# EAGLE schematic qsd67lc_v2 (EAGLE 9.3.1)

## Sheet 1 of 12: Supply
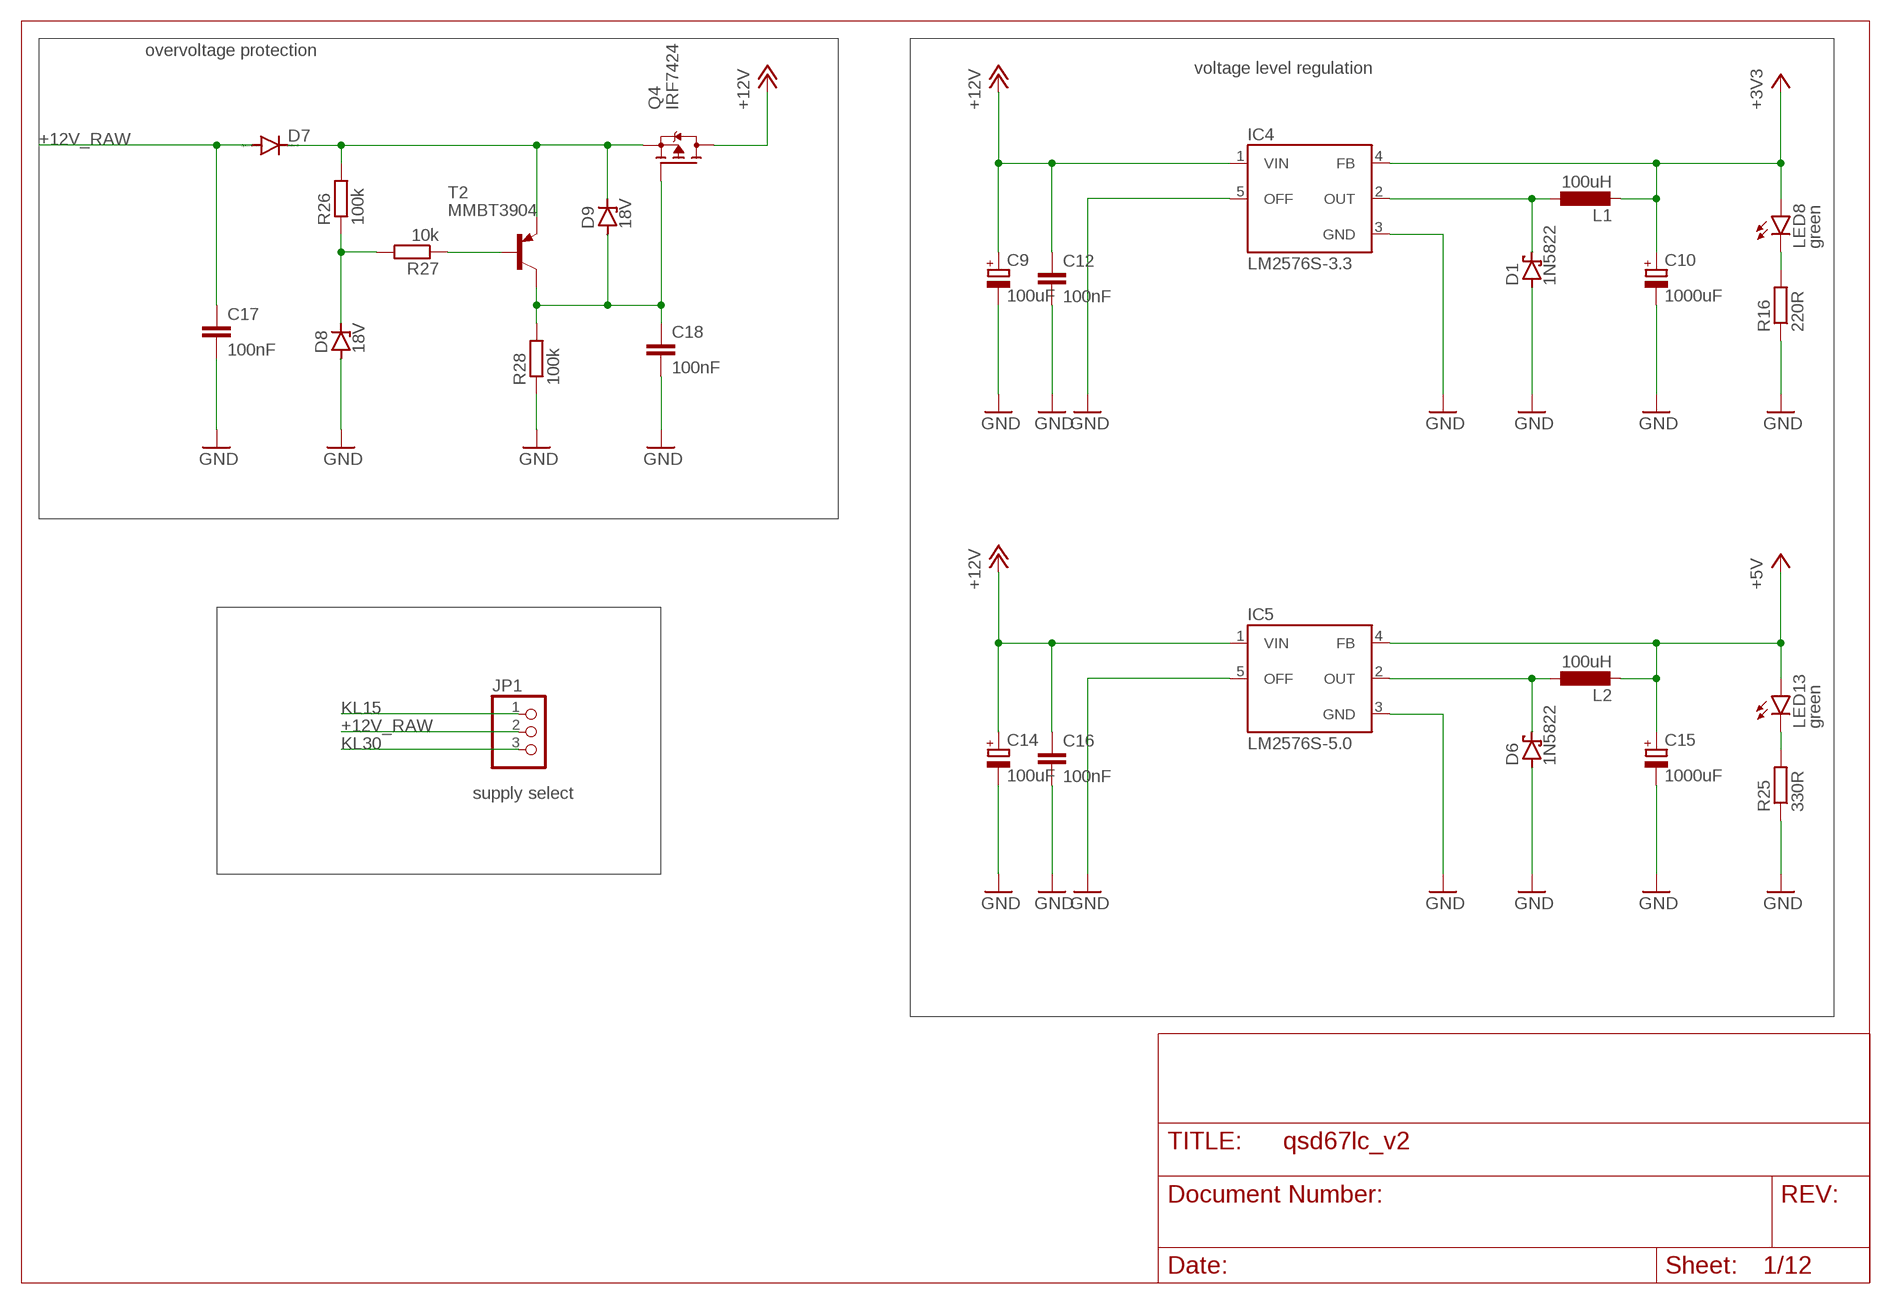
[diagram p0: schematic, sheet 1]

### Parts
C9  100uF  CPOL-EUE5-10.5  [E5-10,5]
C10  1000uF  CPOL-EUE5-10.5  [E5-10,5]
C12  100nF  C-EUC0805  [C0805]
C14  100uF  CPOL-EUE5-10.5  [E5-10,5]
C15  1000uF  CPOL-EUE5-10.5  [E5-10,5]
C16  100nF  C-EUC0805  [C0805]
C17  100nF  C-EUC0805  [C0805]
C18  100nF  C-EUC0805  [C0805]
D1  1N5822  SCHOTTKY-DIODEDO201T15  [DO201T15]
D6  1N5822  SCHOTTKY-DIODEDO201T15  [DO201T15]
D7  DIODE-SOD123  [SOD123]
D8  18V  ZENER-DIODESOD80C  [SOD80C]
D9  18V  ZENER-DIODESOD80C  [SOD80C]
IC4  LM2576S-3.3  LM2576S  [TO263-5]
IC5  LM2576S-5.0  LM2576S  [TO263-5]
JP1  PINHD-1X3  [1X03]
L1  100uH  L-LEU-09HCP  [09HCP]
L2  100uH  L-LEU-09HCP  [09HCP]
LED8  green  LEDCHIP-LED0805  [CHIP-LED0805]
LED13  green  LEDCHIP-LED0805  [CHIP-LED0805]
Q4  IRF7424  BSO201SP  [SO-8]
R16  220R  R-EU_R0805  [R0805]
R25  330R  R-EU_R0805  [R0805]
R26  100k  R-EU_R0805  [R0805]
R27  10k  R-EU_R0805  [R0805]
R28  100k  R-EU_R0805  [R0805]
T2  MMBT3904  BC807-16-PNP-SOT23-BEC  [SOT23-BEC]

### Nets
+3V3: C10.+ IC4.4(FB) L1.P$2 LED8.A ; also sheet 2,3,4,7,8,9,10,11
+5V: C15.+ IC5.4(FB) L2.P$2 LED13.A ; also sheet 2,10,11
+12V: C9.+ C12.1 C14.+ C16.1 IC4.1(VIN) IC5.1(VIN) Q4.5(D) Q4.6(D) Q4.7(D) Q4.8(D) ; also sheet 2,5,9,11
+12V_RAW: C17.1 D7.A JP1.2
GND: C9.- C10.- C12.2 C14.- C15.- C16.2 C17.2 C18.2 D1.A D6.A D8.A IC4.3(GND) IC4.5(OFF) IC5.3(GND) IC5.5(OFF) R16.1 R25.1 R28.1 ; also sheet 2,3,4,5,6,7,8,9,10,11
KL15: JP1.1 ; also sheet 5,6
KL30: JP1.3 ; also sheet 8
N$11: LED8.C R16.2
N$19: D7.C D9.C Q4.1(S) Q4.2(S) Q4.3(S) R26.2 T2.E
N$22: D1.C IC4.2(OUT) L1.P$1
N$30: D6.C IC5.2(OUT) L2.P$1
N$31: LED13.C R25.2
N$32: D8.C R26.1 R27.2
N$33: R27.1 T2.B
N$34: C18.1 D9.A Q4.4(G) R28.2 T2.C

### Notes on the sheet
- overvoltage protection
- voltage level regulation
- supply select

## Sheet 2 of 12: atmega8
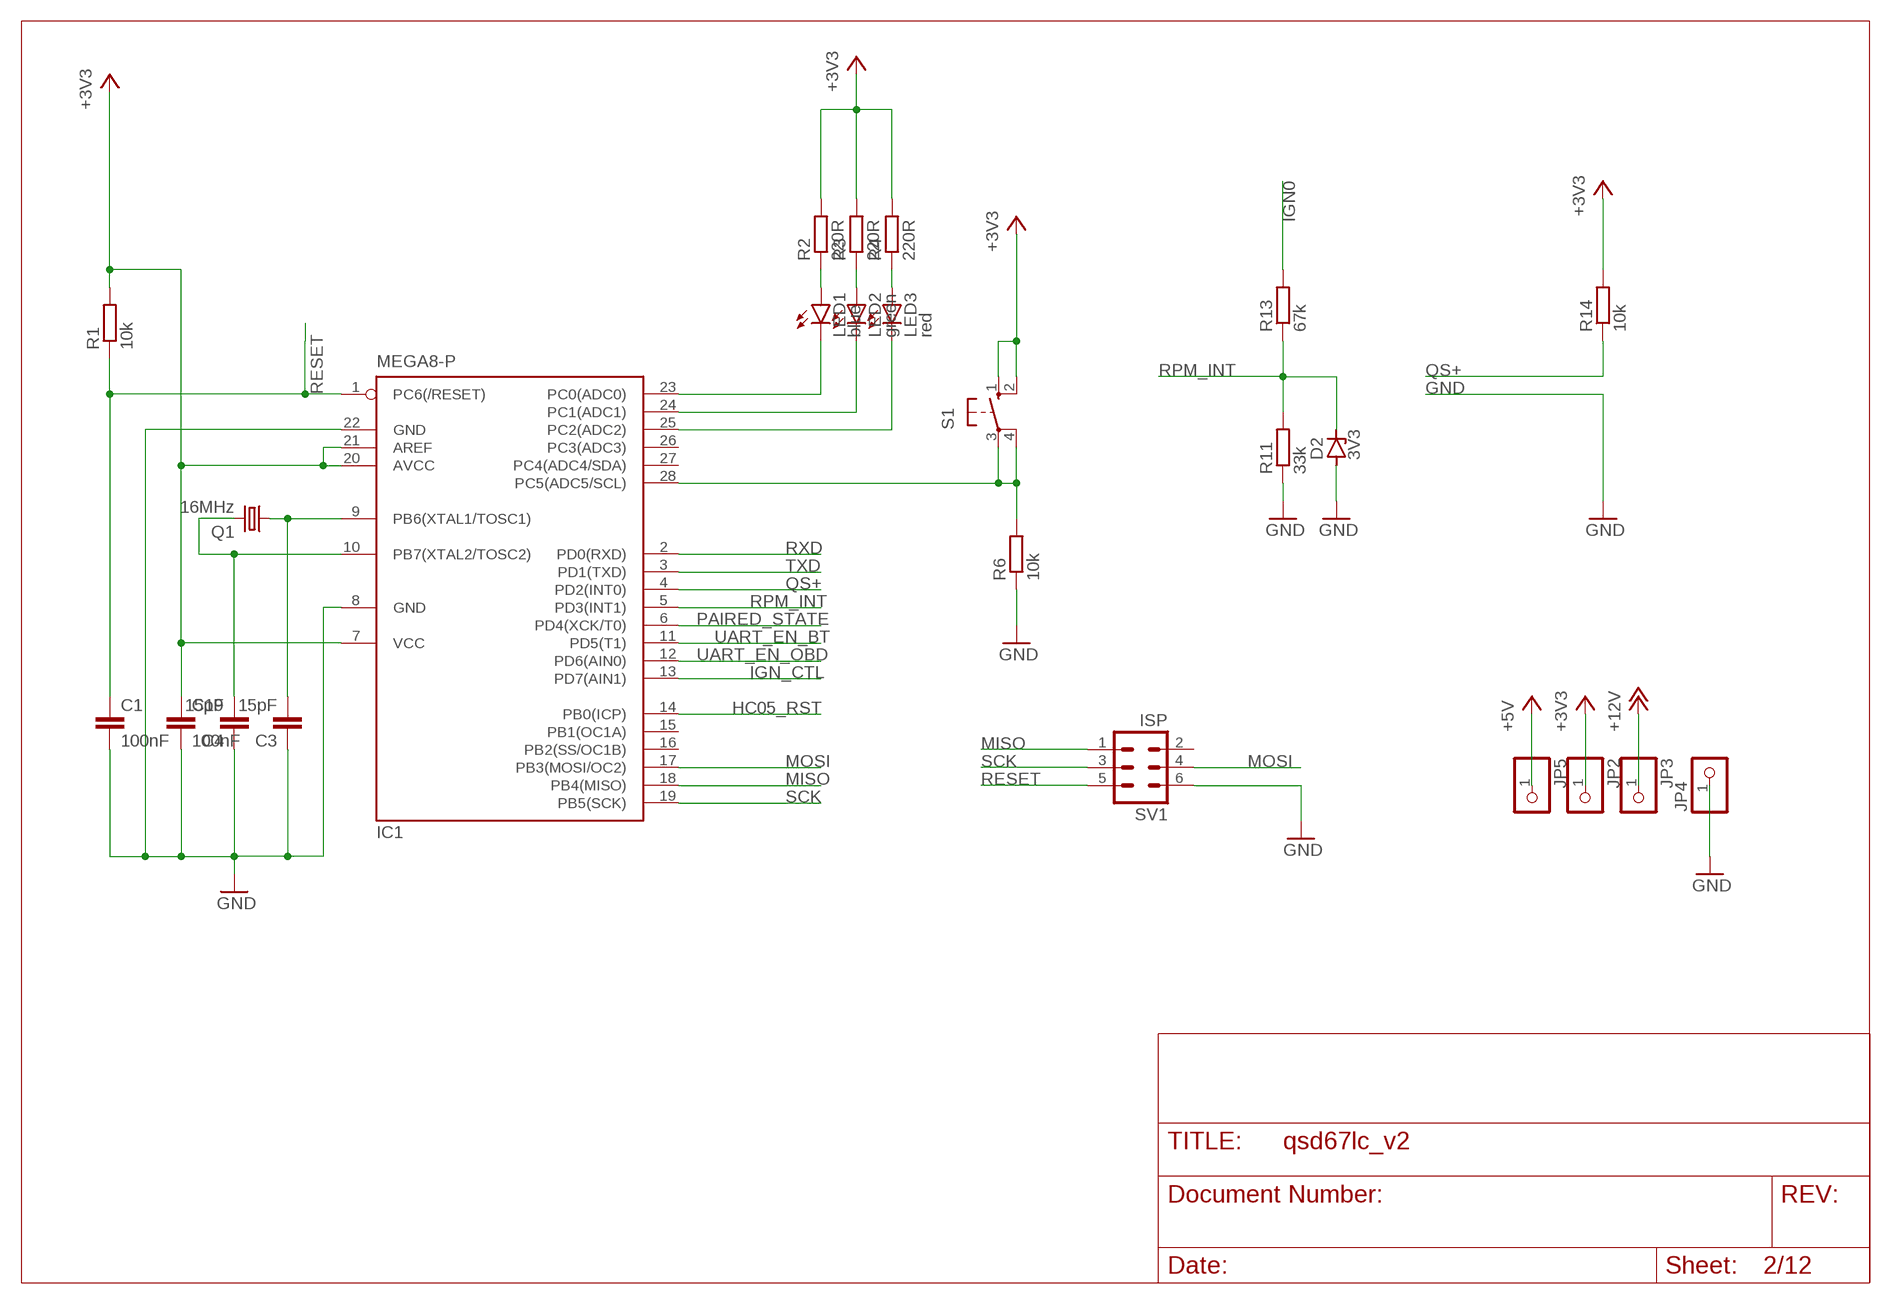
[diagram p1: schematic, sheet 2]

### Parts
C1  100nF  C-EUC0805  [C0805]
C3  15pF  C-EUC0805  [C0805]
C4  15pF  C-EUC0805  [C0805]
C19  100nF  C-EUC0805  [C0805]
D2  3V3  ZENER-DIODESOD80C  [SOD80C]
IC1  MEGA8-P  [DIL28-3]
JP2  PINHD-1X1  [1X01]
JP3  PINHD-1X1  [1X01]
JP4  PINHD-1X1  [1X01]
JP5  PINHD-1X1  [1X01]
LED1  blue  LEDCHIP-LED0805  [CHIP-LED0805]
LED2  green  LEDCHIP-LED0805  [CHIP-LED0805]
LED3  red  LEDCHIP-LED0805  [CHIP-LED0805]
Q1  16MHz  CRYSTALHC49U-V  [HC49U-V]
R1  10k  R-EU_R0805  [R0805]
R2  220R  R-EU_R0805  [R0805]
R3  220R  R-EU_R0805  [R0805]
R4  220R  R-EU_R0805  [R0805]
R6  10k  R-EU_R0805  [R0805]
R11  33k  R-EU_R0805  [R0805]
R13  67k  R-EU_R0805  [R0805]
R14  10k  R-EU_R0805  [R0805]
S1  10-XX  [B3F-10XX]
SV1  ISP  ML6  [ML6]

### Nets
+3V3: C19.1 IC1.7(VCC) IC1.20(AVCC) IC1.21(AREF) JP2.1 R1.2 R2.2 R3.2 R4.2 R14.2 S1.1(S) S1.2(S1) ; also sheet 1,3,4,7,8,9,10,11
+5V: JP5.1 ; also sheet 1,10,11
+12V: JP3.1 ; also sheet 1,5,9,11
GND: C1.2 C3.1 C4.1 C19.2 D2.A IC1.8(GND) IC1.22(GND) JP4.1 R6.1 R11.1 SV1.6 ; also sheet 1,3,4,5,6,7,8,9,10,11
HC05_RST: IC1.14(PB0(ICP)) ; also sheet 3
IGN0: R13.2 ; also sheet 6
IGN_CTL: IC1.13(PD7(AIN1)) ; also sheet 5
MISO: IC1.18(PB4(MISO)) SV1.1
MOSI: IC1.17(PB3(MOSI/OC2)) SV1.4
N$2: C3.2 IC1.9(PB6(XTAL1/TOSC1)) Q1.1
N$3: C4.2 IC1.10(PB7(XTAL2/TOSC2)) Q1.2
N$4: LED2.A R3.1
N$5: LED1.A R2.1
N$6: LED3.A R4.1
N$7: IC1.23(PC0(ADC0)) LED1.C
N$9: IC1.24(PC1(ADC1)) LED2.C
N$12: IC1.28(PC5(ADC5/SCL)) R6.2 S1.3(P) S1.4(P1)
N$20: IC1.25(PC2(ADC2)) LED3.C
PAIRED_STATE: IC1.6(PD4(XCK/T0)) ; also sheet 3
QS+: IC1.4(PD2(INT0)) R14.1 ; also sheet 6
RESET: C1.1 IC1.1(PC6(/RESET)) R1.1 SV1.5
RPM_INT: D2.C IC1.5(PD3(INT1)) R11.2 R13.1
RXD: IC1.2(PD0(RXD)) ; also sheet 4
SCK: IC1.19(PB5(SCK)) SV1.3
TXD: IC1.3(PD1(TXD)) ; also sheet 4
UART_EN_BT: IC1.11(PD5(T1)) ; also sheet 4
UART_EN_OBD: IC1.12(PD6(AIN0)) ; also sheet 4
Unconnected: IC1.15(PB1(OC1A)) IC1.16(PB2(SS/OC1B)) IC1.26(PC3(ADC3)) IC1.27(PC4(ADC4/SDA)) SV1.2

## Sheet 3 of 12: bluetooth
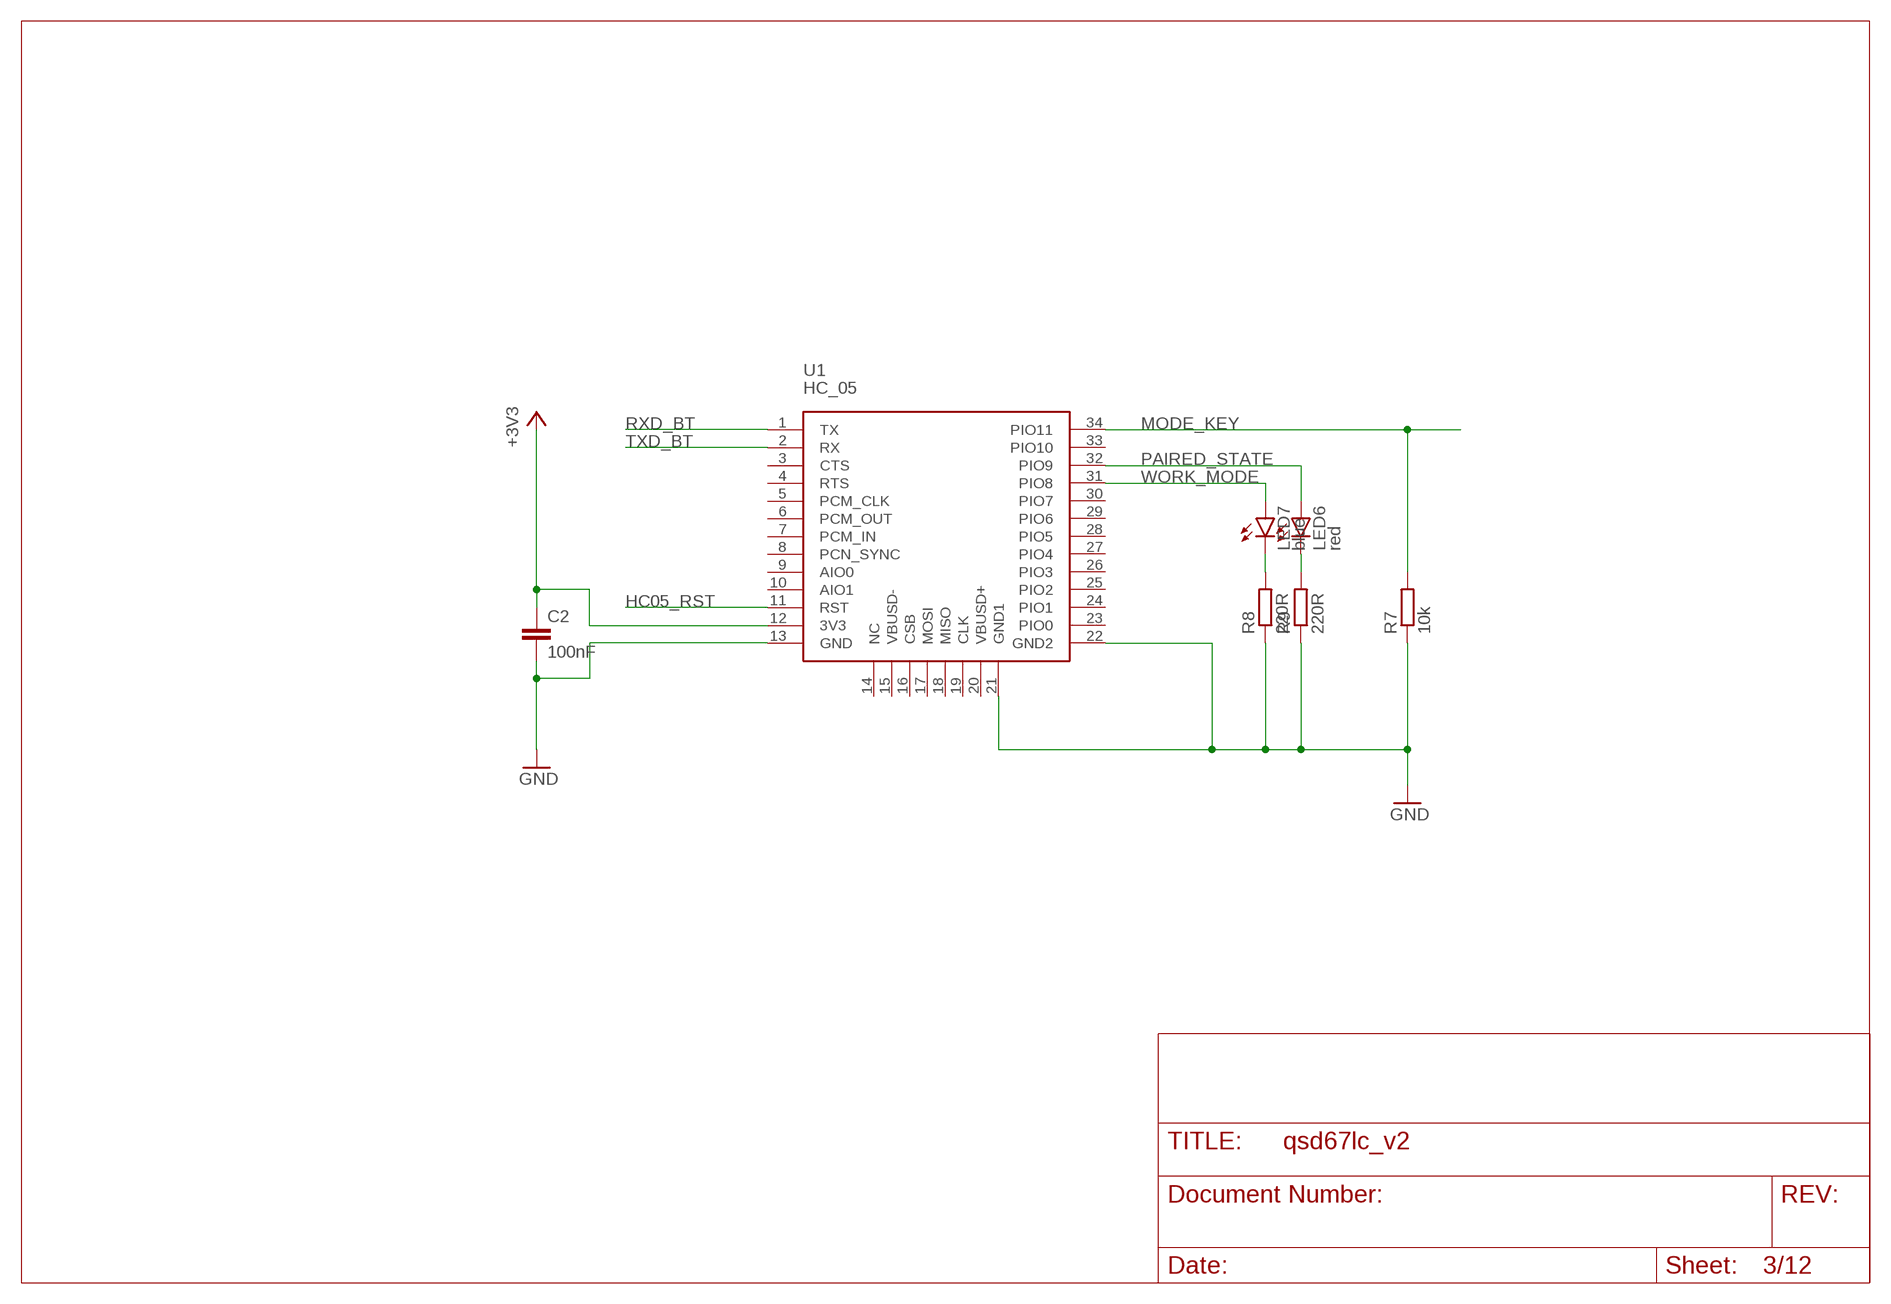
[diagram p2: schematic, sheet 3]

### Parts
C2  100nF  C-EUC0805  [C0805]
LED6  red  LEDCHIP-LED0805  [CHIP-LED0805]
LED7  blue  LEDCHIP-LED0805  [CHIP-LED0805]
R7  10k  R-EU_R0805  [R0805]
R8  220R  R-EU_R0805  [R0805]
R9  220R  R-EU_R0805  [R0805]
U1  HC_05  [BLUETOOTH_SMD]

### Nets
+3V3: C2.1 U1.12(3V3) ; also sheet 1,2,4,7,8,9,10,11
GND: C2.2 R7.1 R8.1 R9.1 U1.13(GND) U1.21(GND1) U1.22(GND2) ; also sheet 1,2,4,5,6,7,8,9,10,11
HC05_RST: U1.11(RST) ; also sheet 2
MODE_KEY: R7.2 U1.34(PIO11)
N$13: LED7.C R8.2
N$14: LED6.C R9.2
PAIRED_STATE: LED6.A U1.32(PIO9) ; also sheet 2
RXD_BT: U1.1(TX) ; also sheet 4
TXD_BT: U1.2(RX) ; also sheet 4
WORK_MODE: LED7.A U1.31(PIO8)
Unconnected: U1.3(CTS) U1.4(RTS) U1.5(PCM_CLK) U1.6(PCM_OUT) U1.7(PCM_IN) U1.8(PCN_SYNC) U1.9(AIO0) U1.10(AIO1) U1.14(NC) U1.15(VBUSD-) U1.16(CSB) U1.17(MOSI) U1.18(MISO) U1.19(CLK) U1.20(VBUSD+) U1.23(PIO0) U1.24(PIO1) U1.25(PIO2) U1.26(PIO3) U1.27(PIO4) U1.28(PIO5) U1.29(PIO6) U1.30(PIO7) U1.33(PIO10)

## Sheet 4 of 12: UART switch logic
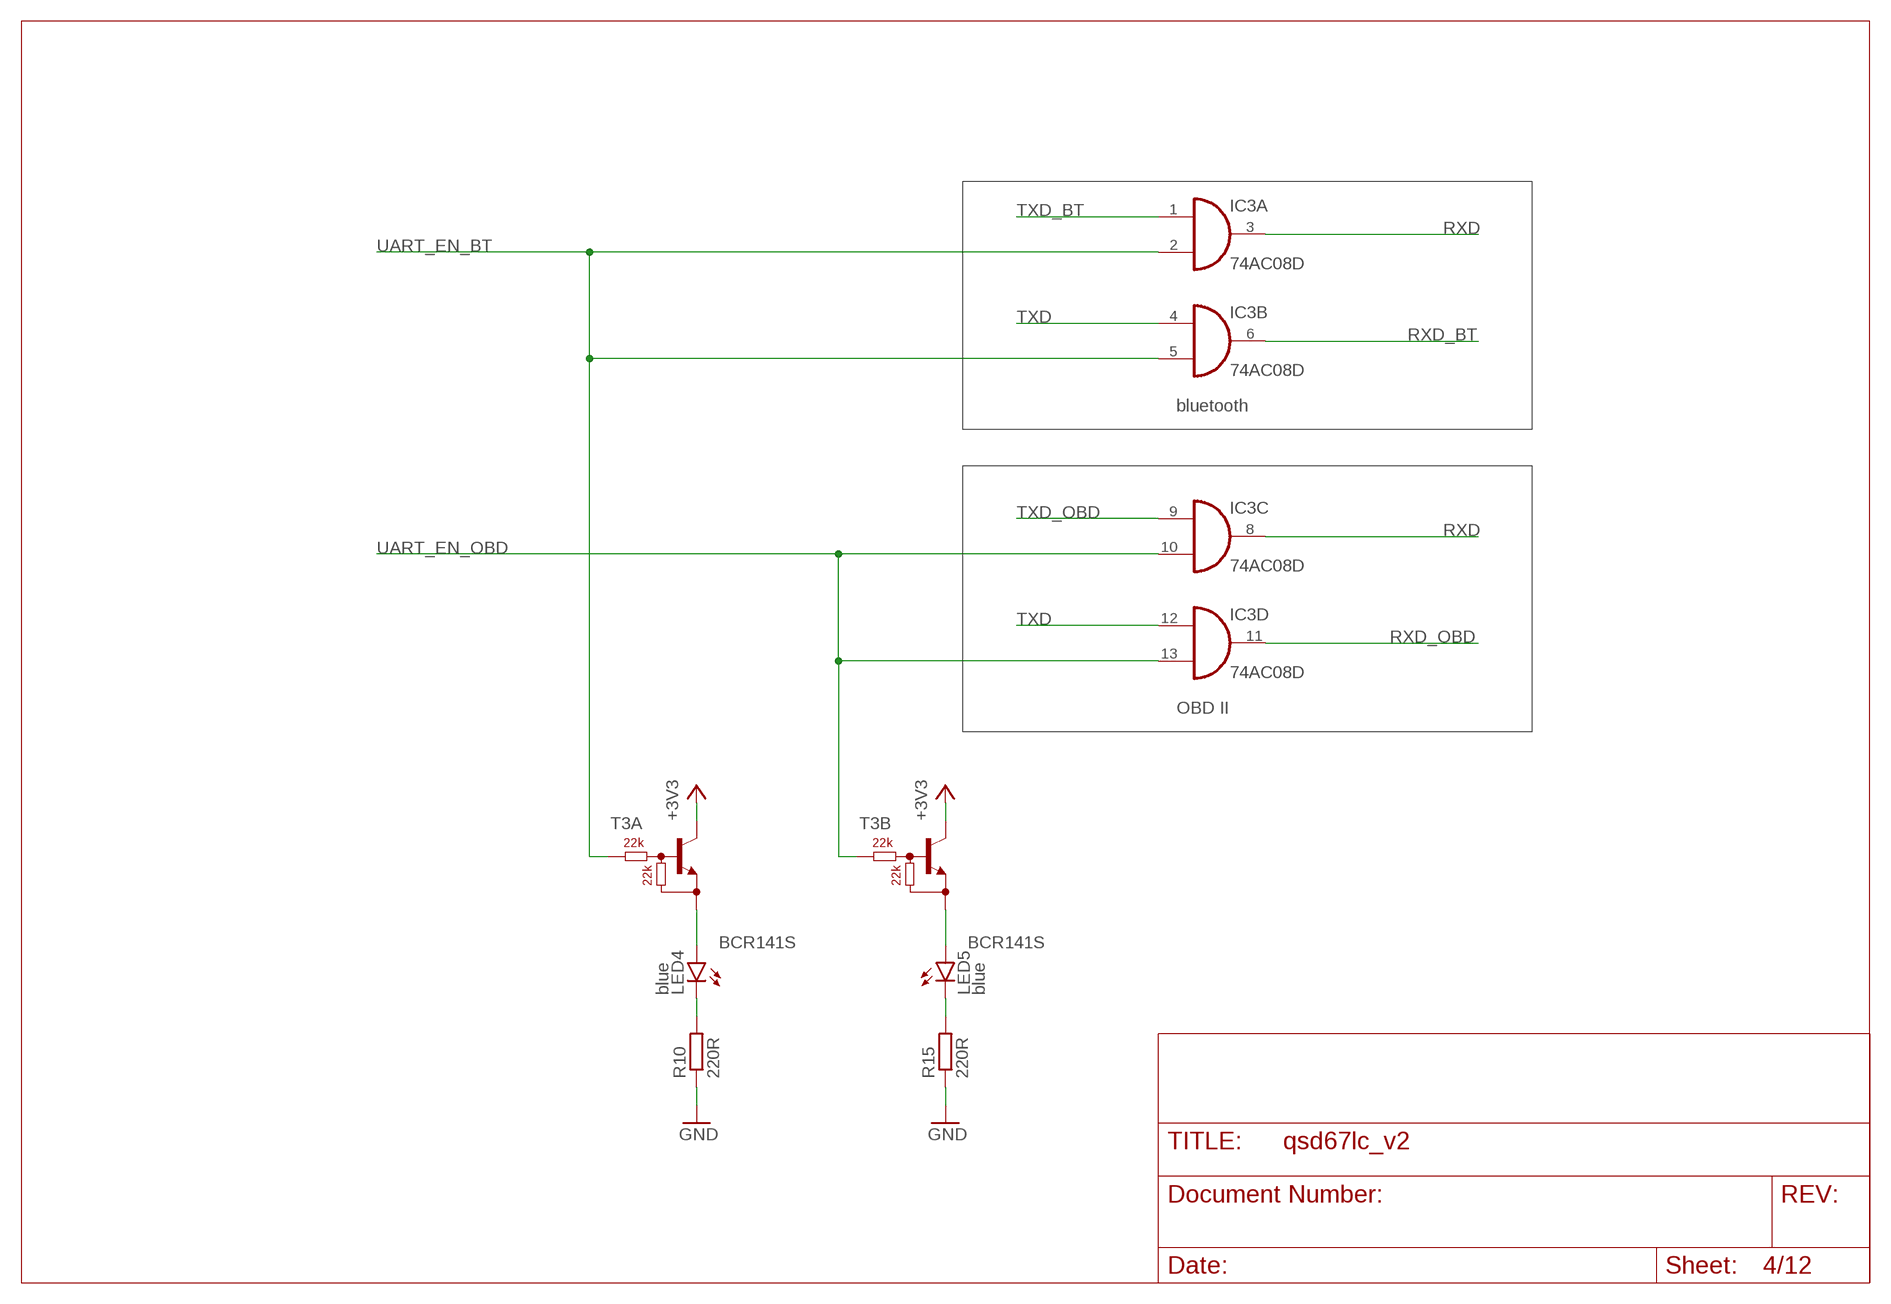
[diagram p3: schematic, sheet 4]

### Parts
IC3  74AC08D  [SO14]
LED4  blue  LEDCHIP-LED0805  [CHIP-LED0805]
LED5  blue  LEDCHIP-LED0805  [CHIP-LED0805]
R10  220R  R-EU_M0805  [M0805]
R15  220R  R-EU_M0805  [M0805]
T3  BCR141S  [SOT363_INFINEON]

### Nets
+3V3: T3.3(B:C) T3.6(A:C) ; also sheet 1,2,3,7,8,9,10,11
GND: R10.1 R15.1 ; also sheet 1,2,3,5,6,7,8,9,10,11
N$8: LED4.C R10.2
N$10: LED5.C R15.2
N$15: LED4.A T3.1(A:E)
N$17: LED5.A T3.4(B:E)
RXD: IC3.3(A:O) IC3.8(C:O) ; also sheet 2
RXD_BT: IC3.6(B:O) ; also sheet 3
RXD_OBD: IC3.11(D:O) ; also sheet 7
TXD: IC3.4(B:I0) IC3.12(D:I0) ; also sheet 2
TXD_BT: IC3.1(A:I0) ; also sheet 3
TXD_OBD: IC3.9(C:I0) ; also sheet 7
UART_EN_BT: IC3.2(A:I1) IC3.5(B:I1) T3.2(A:B) ; also sheet 2
UART_EN_OBD: IC3.10(C:I1) IC3.13(D:I1) T3.5(B:B) ; also sheet 2

### Notes on the sheet
- bluetooth
- OBD II

## Sheet 5 of 12: ignition
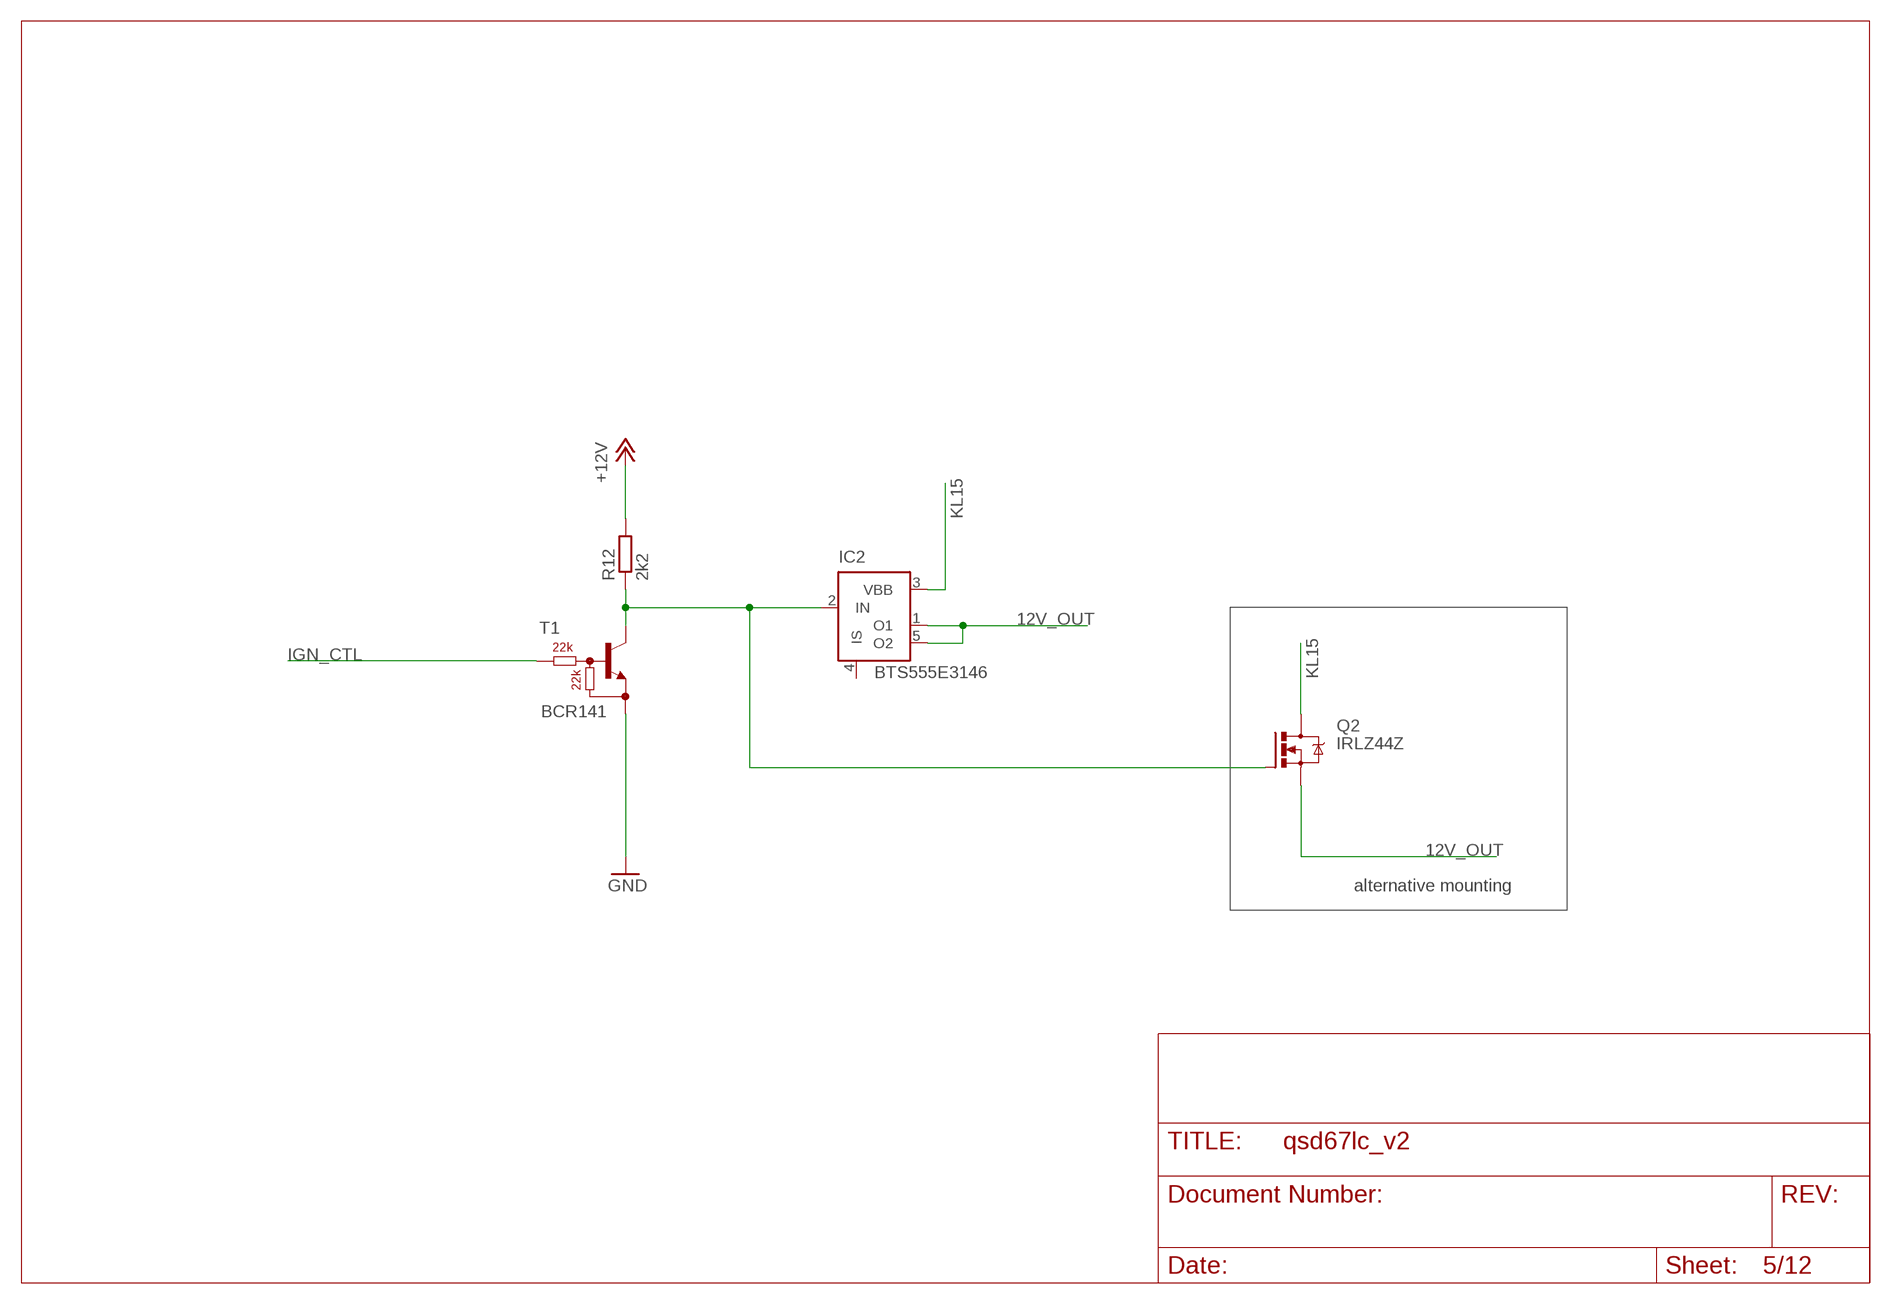
[diagram p4: schematic, sheet 5]

### Parts
IC2  BTS555E3146  [TO220-52]
Q2  IRLZ44Z  [TO220BH]
R12  2k2  R-EU_R0805  [R0805]
T1  BCR141  [SOT23-R_INFINEON]

### Nets
12V_OUT: IC2.1(O1) IC2.5(O2) Q2.S ; also sheet 6
+12V: R12.2 ; also sheet 1,2,9,11
GND: T1.2(E) ; also sheet 1,2,3,4,6,7,8,9,10,11
IGN_CTL: T1.1(B) ; also sheet 2
KL15: IC2.3(VBB) Q2.D ; also sheet 1,6
N$16: IC2.2(IN) Q2.G R12.1 T1.3(C)
Unconnected: IC2.4(IS)

### Notes on the sheet
- alternative mounting

## Sheet 6 of 12: Connectors
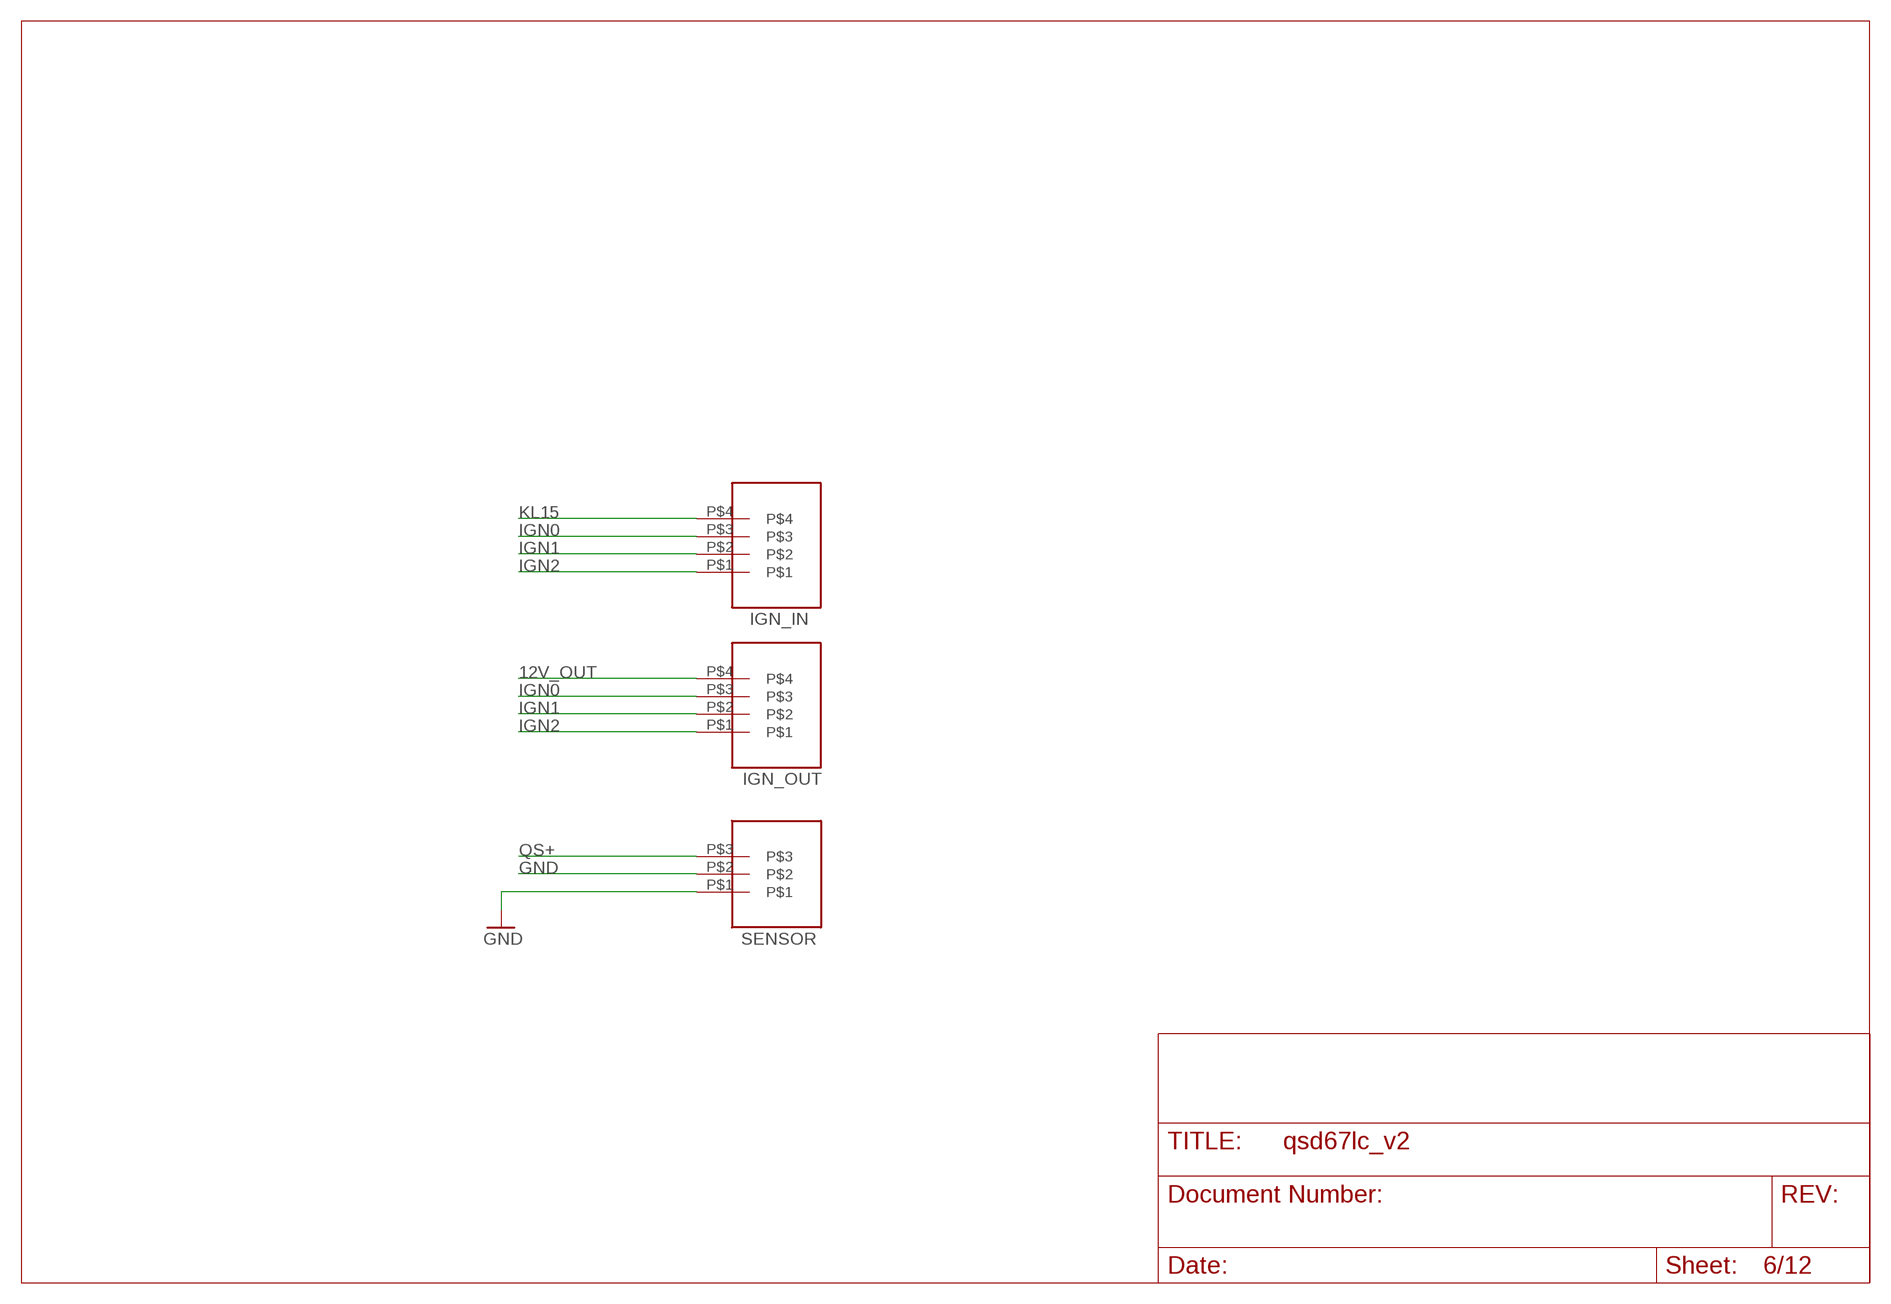
[diagram p5: schematic, sheet 6]

### Parts
CON1  RIA-AKL-230-04  [CON-RIA-P4]
CON2  RIA-AKL-230-04  [CON-RIA-P4]
CON3  RIA-AKL-230-03  [CON-RIA-P3]

### Nets
12V_OUT: CON2.P$4 ; also sheet 5
GND: CON3.P$1 CON3.P$2 ; also sheet 1,2,3,4,5,7,8,9,10,11
IGN0: CON1.P$3 CON2.P$3 ; also sheet 2
IGN1: CON1.P$2 CON2.P$2
IGN2: CON1.P$1 CON2.P$1
KL15: CON1.P$4 ; also sheet 1,5
QS+: CON3.P$3 ; also sheet 2

### Notes on the sheet
- IGN_IN
- IGN_OUT
- SENSOR

## Sheet 7 of 12: OBDII STN1110
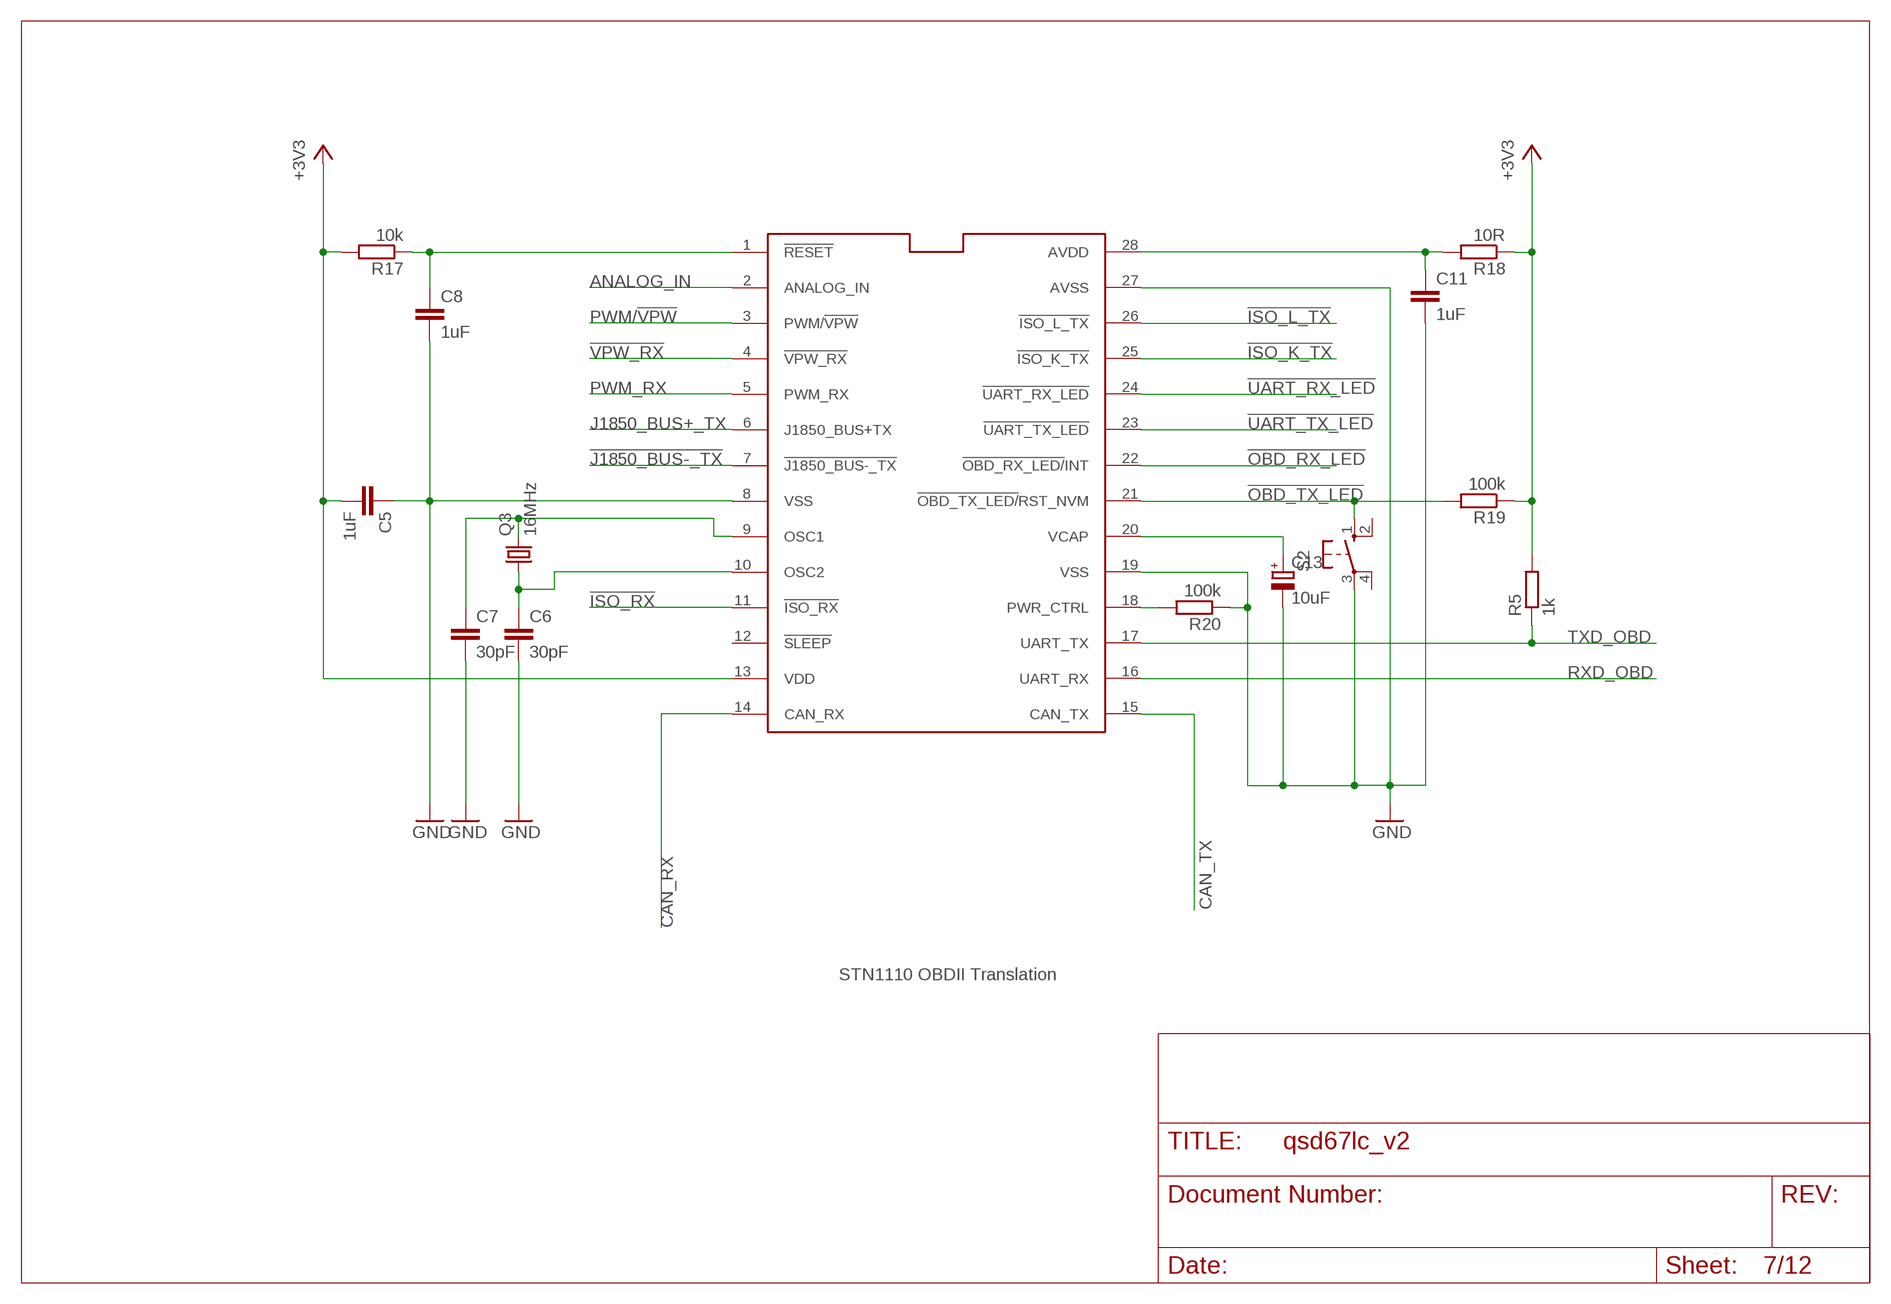
[diagram p6: schematic, sheet 7]

### Parts
C5  1uF  C-EUC0805  [C0805]
C6  30pF  C-EUC0805  [C0805]
C7  30pF  C-EUC0805  [C0805]
C8  1uF  C-EUC0805  [C0805]
C11  1uF  C-EUC0805  [C0805]
C13  10uF  CPOL-EUE2-5  [E2-5]
Q3  16MHz  CRYSTALHC49U-V  [HC49U-V]
R5  1k  R-EU_R0805  [R0805]
R17  10k  R-EU_R0805  [R0805]
R18  10R  R-EU_R0805  [R0805]
R19  100k  R-EU_R0805  [R0805]
R20  100k  R-EU_R0805  [R0805]
S2  RST_NVM  10-XX  [B3F-10XX]
U$1  STN1110-SOIC28  [SOIC28L]

### Nets
!ISO_K_TX: U$1.25(!ISO_K_TX) ; also sheet 9
!ISO_L_TX: U$1.26(!ISO_L_TX) ; also sheet 9
!ISO_RX: U$1.11(!ISO_RX) ; also sheet 9
!J1850_BUS-_TX: U$1.7(!J1850_BUS-_TX) ; also sheet 11
!OBD_RX_LED: U$1.22(!OBD_RX_LED/!INT) ; also sheet 8
!OBD_TX_LED: R19.2 S2.1(S) U$1.21(!OBD_TX_LED/!RST_NVM) ; also sheet 8
!UART_RX_LED: U$1.24(!UART_RX_LED) ; also sheet 8
!UART_TX_LED: U$1.23(!UART_TX_LED) ; also sheet 8
!VPW_RX: U$1.4(!VPW_RX) ; also sheet 11
+3V3: C5.2 R5.2 R17.2 R18.1 R19.1 U$1.13(VDD) ; also sheet 1,2,3,4,8,9,10,11
ANALOG_IN: U$1.2(ANALOG_IN)
CAN_RX: U$1.14(CAN_RX) ; also sheet 10
CAN_TX: U$1.15(CAN_TX) ; also sheet 10
GND: C5.1 C6.2 C7.2 C8.2 C11.2 C13.- R20.1 S2.3(P) U$1.8(VSS) U$1.19(VSS) U$1.27(AVSS) ; also sheet 1,2,3,4,5,6,8,9,10,11
J1850_BUS+_TX: U$1.6(J1850_BUS+TX) ; also sheet 11
N$1: C8.1 R17.1 U$1.1(!RESET)
N$18: C7.1 Q3.2 U$1.9(OSC1)
N$21: C11.1 R18.2 U$1.28(AVDD)
N$23: C6.1 Q3.1 U$1.10(OSC2)
N$24: C13.+ U$1.20(VCAP)
N$25: R20.2 U$1.18(PWR_CTRL)
PWM/!VPW: U$1.3(PWM/!VPW) ; also sheet 11
PWM_RX: U$1.5(PWM_RX) ; also sheet 11
RXD_OBD: U$1.16(UART_RX) ; also sheet 4
TXD_OBD: R5.1 U$1.17(UART_TX) ; also sheet 4
Unconnected: S2.2(S1) S2.4(P1) U$1.12(!SLEEP)

### Notes on the sheet
- STN1110 OBDII Translation

## Sheet 8 of 12: OBDII peripherals
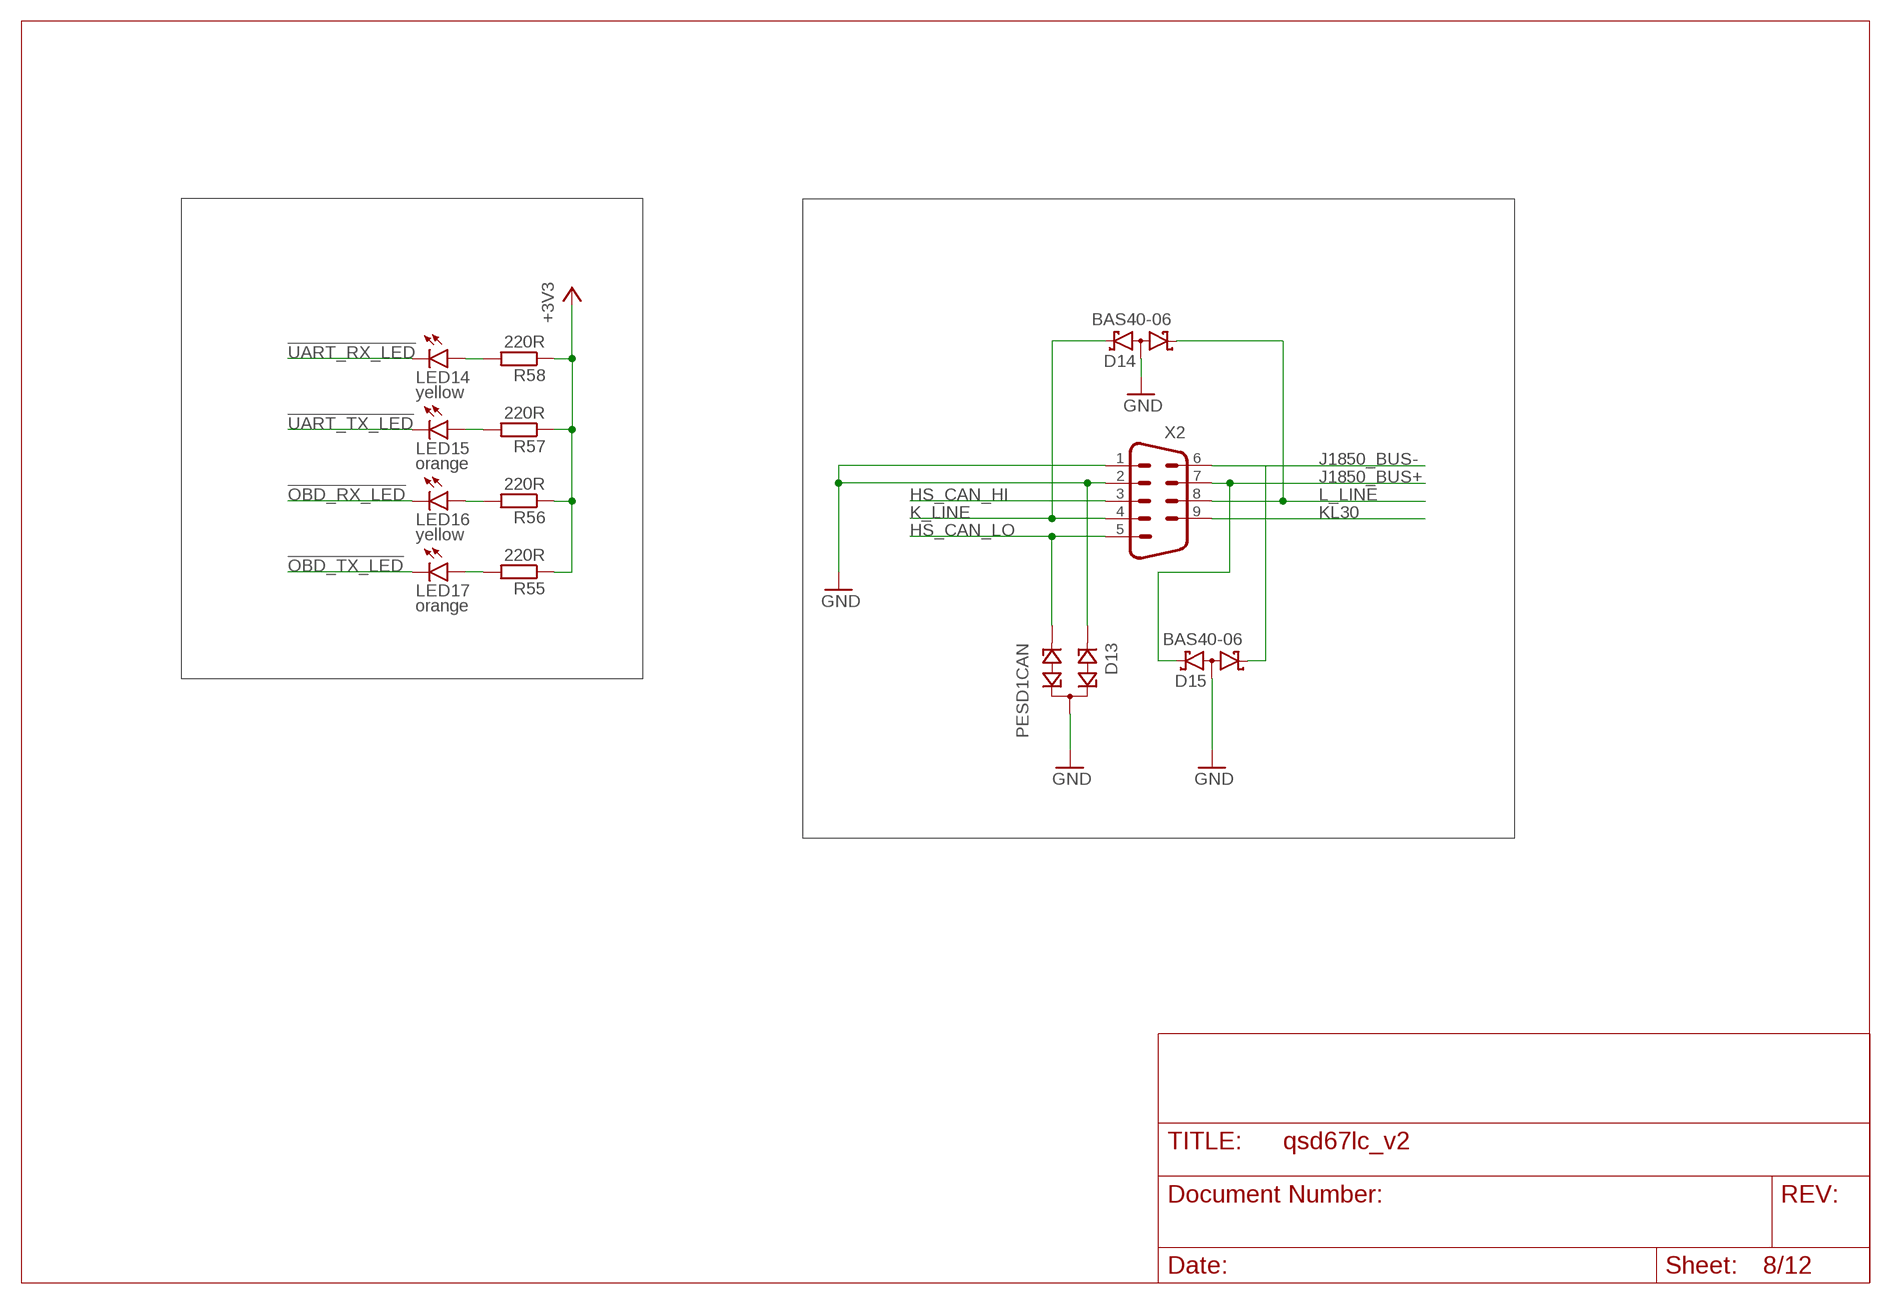
[diagram p7: schematic, sheet 8]

### Parts
D13  PESD1CAN  [SOT23]
D14  BAS40-06  [SOT23]
D15  BAS40-06  [SOT23]
LED14  yellow  LEDCHIP-LED0805  [CHIP-LED0805]
LED15  orange  LEDCHIP-LED0805  [CHIP-LED0805]
LED16  yellow  LEDCHIP-LED0805  [CHIP-LED0805]
LED17  orange  LEDCHIP-LED0805  [CHIP-LED0805]
R55  220R  R-EU_R0805  [R0805]
R56  220R  R-EU_R0805  [R0805]
R57  220R  R-EU_R0805  [R0805]
R58  220R  R-EU_R0805  [R0805]
X2  M09HP  [M09HP]

### Nets
!OBD_RX_LED: LED16.C ; also sheet 7
!OBD_TX_LED: LED17.C ; also sheet 7
!UART_RX_LED: LED14.C ; also sheet 7
!UART_TX_LED: LED15.C ; also sheet 7
+3V3: R55.1 R56.1 R57.1 R58.1 ; also sheet 1,2,3,4,7,9,10,11
GND: D13.1 D13.3 D14.3(AA) D15.3(AA) X2.1 X2.2 ; also sheet 1,2,3,4,5,6,7,9,10,11
HS_CAN_HI: X2.3 ; also sheet 10
HS_CAN_LO: D13.2 X2.5 ; also sheet 10
J1850_BUS+: D15.2(K2) X2.7 ; also sheet 11
J1850_BUS-: D15.1(K1) X2.6 ; also sheet 11
K_LINE: D14.2(K2) X2.4 ; also sheet 9
KL30: X2.9 ; also sheet 1
L_LINE: D14.1(K1) X2.8 ; also sheet 9
N$52: LED17.A R55.2
N$54: LED16.A R56.2
N$55: LED15.A R57.2
N$56: LED14.A R58.2

## Sheet 9 of 12: OBDII ISO 9141
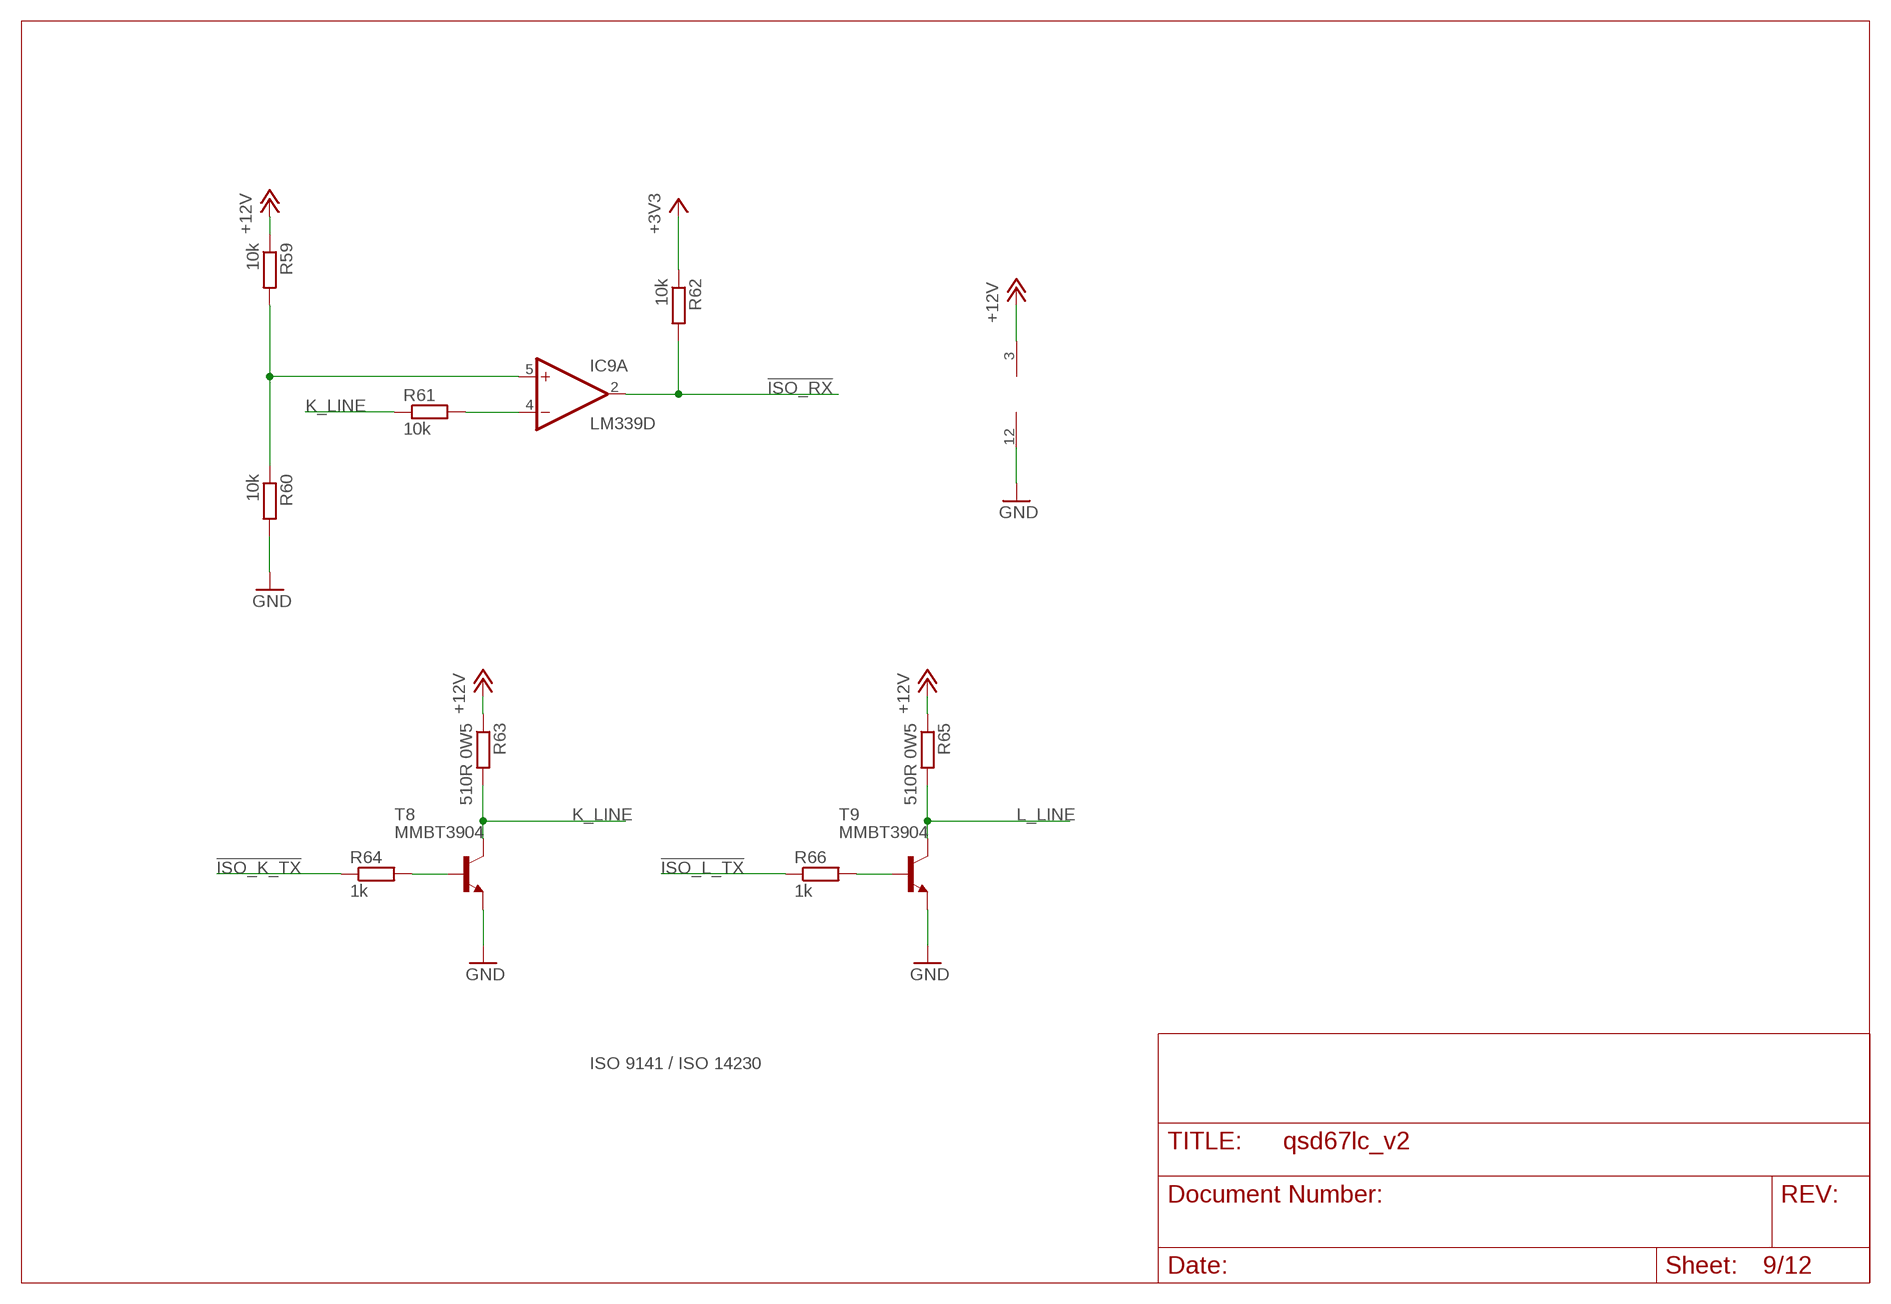
[diagram p8: schematic, sheet 9]

### Parts
IC9  LM339D  [SO14]
R59  10k  R-EU_R0805  [R0805]
R60  10k  R-EU_R0805  [R0805]
R61  10k  R-EU_R0805  [R0805]
R62  10k  R-EU_R0805  [R0805]
R63  510R 0W5  R-EU_0207/12  [0207/12]
R64  1k  R-EU_R0805  [R0805]
R65  510R 0W5  R-EU_0207/12  [0207/12]
R66  1k  R-EU_R0805  [R0805]
T8  MMBT3904  MMBT3904LT1-NPN-SOT23-BEC  [SOT23-BEC]
T9  MMBT3904  BC817-16-NPN-SOT23-BEC  [SOT23-BEC]

### Nets
!ISO_K_TX: R64.1 ; also sheet 7
!ISO_L_TX: R66.1 ; also sheet 7
!ISO_RX: IC9.2(A:OUT) R62.2 ; also sheet 7
+3V3: R62.1 ; also sheet 1,2,3,4,7,8,10,11
+12V: IC9.3(P:V+) R59.1 R63.1 R65.1 ; also sheet 1,2,5,11
GND: IC9.12(P:GND) R60.2 T8.E T9.E ; also sheet 1,2,3,4,5,6,7,8,10,11
K_LINE: R61.1 R63.2 T8.C ; also sheet 8
L_LINE: R65.2 T9.C ; also sheet 8
N$57: IC9.5(A:+IN) R59.2 R60.1
N$58: IC9.4(A:-IN) R61.2
N$59: R64.2 T8.B
N$60: R66.2 T9.B
Unconnected: IC9.10(D:-IN) IC9.11(D:+IN) IC9.13(D:OUT)

### Notes on the sheet
- ISO 9141 / ISO 14230

## Sheet 10 of 12: OBDII CAN
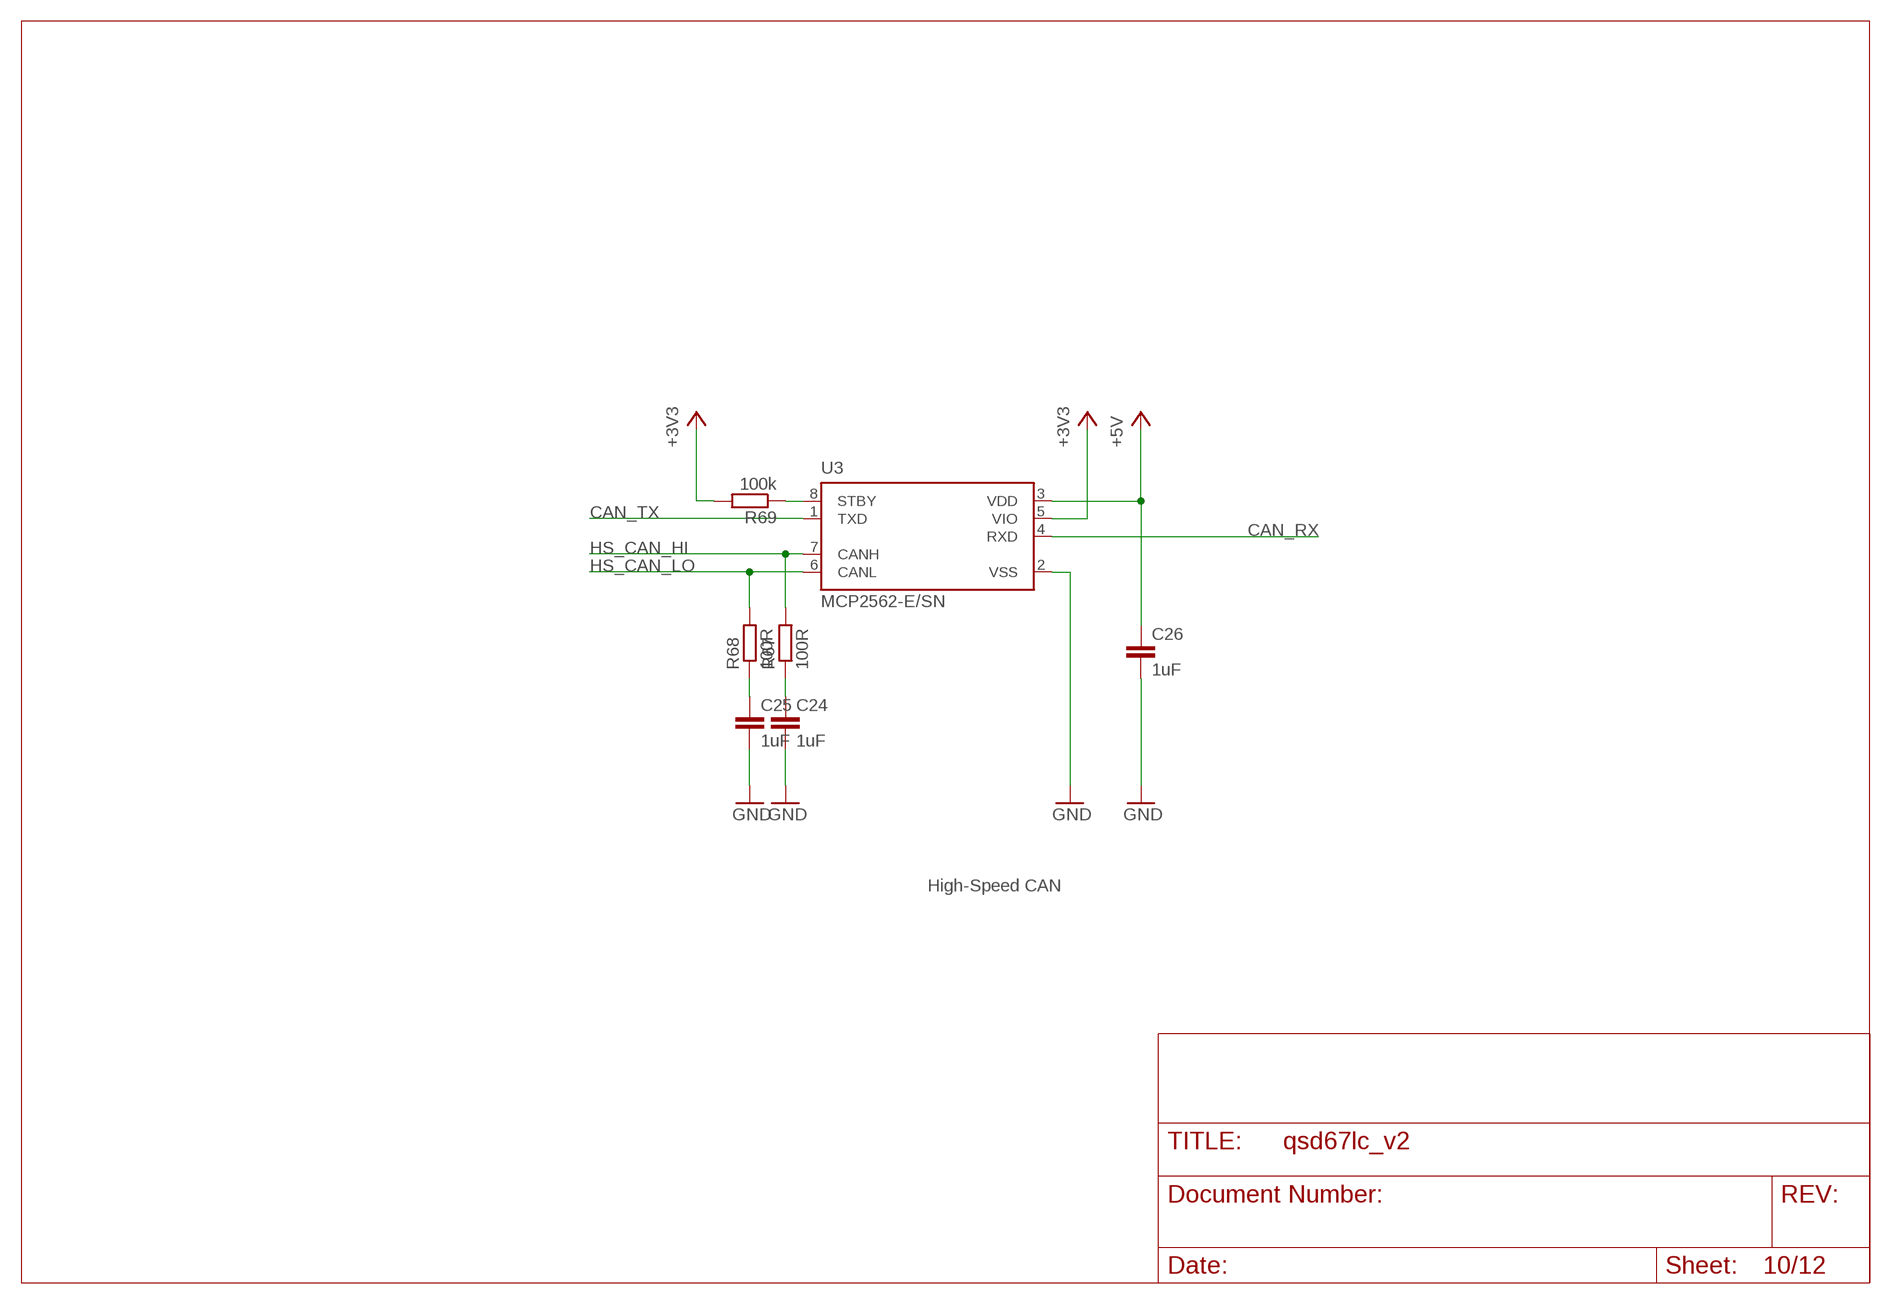
[diagram p9: schematic, sheet 10]

### Parts
C24  1uF  C-EUC0805  [C0805]
C25  1uF  C-EUC0805  [C0805]
C26  1uF  C-EUC0805  [C0805]
R67  100R  R-EU_R0805  [R0805]
R68  100R  R-EU_R0805  [R0805]
R69  100k  R-EU_R0805  [R0805]
U3  MCP2562-E/SN  [SOIC127P600X175-8N]

### Nets
+3V3: R69.2 U3.5(VIO) ; also sheet 1,2,3,4,7,8,9,11
+5V: C26.1 U3.3(VDD) ; also sheet 1,2,11
CAN_RX: U3.4(RXD) ; also sheet 7
CAN_TX: U3.1(TXD) ; also sheet 7
GND: C24.2 C25.2 C26.2 U3.2(VSS) ; also sheet 1,2,3,4,5,6,7,8,9,11
HS_CAN_HI: R67.2 U3.7(CANH) ; also sheet 8
HS_CAN_LO: R68.2 U3.6(CANL) ; also sheet 8
N$61: C25.1 R68.1
N$62: C24.1 R67.1
N$63: R69.1 U3.8(STBY)

### Notes on the sheet
- High-Speed CAN

## Sheet 11 of 12: OBDII SAE J1850 VPW PWM
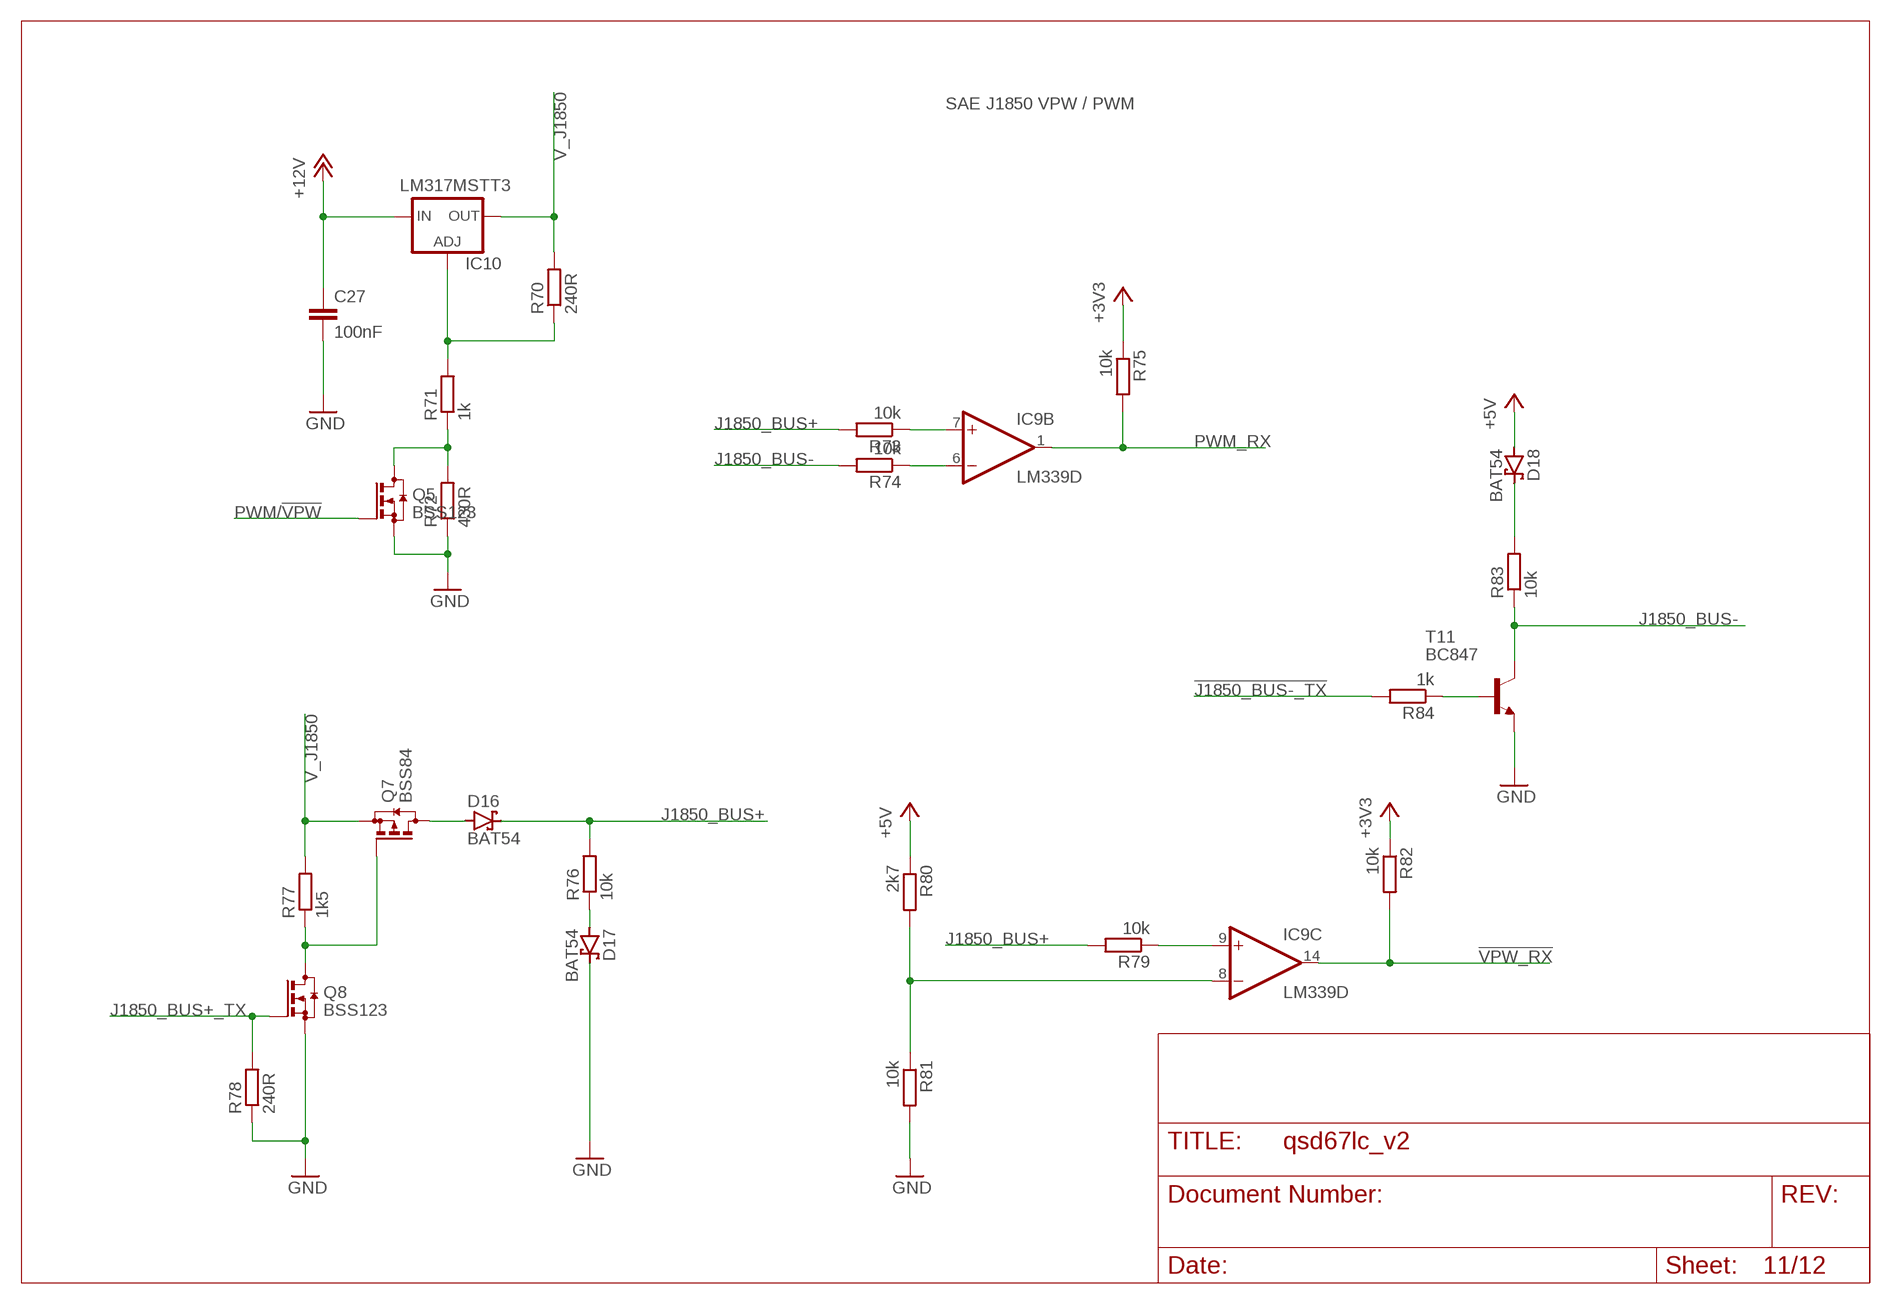
[diagram p10: schematic, sheet 11]

### Parts
C27  100nF  C-EUC0805  [C0805]
D16  BAT54  [SOT23]
D17  BAT54  [SOT23]
D18  BAT54  [SOT23]
IC10  LM317MSTT3  [SOT223]
Q5  BSS123  [SOT23]
Q7  BSS84  [SOT23]
Q8  BSS123  [SOT23]
R70  240R  R-EU_R0805  [R0805]
R71  1k  R-EU_R0805  [R0805]
R72  430R  R-EU_R0805  [R0805]
R73  10k  R-EU_R0805  [R0805]
R74  10k  R-EU_R0805  [R0805]
R75  10k  R-EU_R0805  [R0805]
R76  10k  R-EU_R0805  [R0805]
R77  1k5  R-EU_R0805  [R0805]
R78  240R  R-EU_R0805  [R0805]
R79  10k  R-EU_R0805  [R0805]
R80  2k7  R-EU_R0805  [R0805]
R81  10k  R-EU_R0805  [R0805]
R82  10k  R-EU_R0805  [R0805]
R83  10k  R-EU_R0805  [R0805]
R84  1k  R-EU_R0805  [R0805]
T11  BC847  [SOT23]

### Nets
!J1850_BUS-_TX: R84.2 ; also sheet 7
!VPW_RX: IC9.14(C:OUT) R82.2 ; also sheet 7
+3V3: R75.1 R82.1 ; also sheet 1,2,3,4,7,8,9,10
+5V: D18.1(A) R80.1 ; also sheet 1,2,10
+12V: C27.1 IC10.3(IN) ; also sheet 1,2,5,9
GND: C27.2 D17.3(C) Q5.2(S) Q8.2(S) R72.1 R78.1 R81.2 T11.2(E) ; also sheet 1,2,3,4,5,6,7,8,9,10
J1850_BUS+: D16.3(C) R73.2 R76.2 R79.2 ; also sheet 8
J1850_BUS+_TX: Q8.1(G) R78.2 ; also sheet 7
J1850_BUS-: R74.2 R83.1 T11.3(C) ; also sheet 8
N$64: IC10.1(ADJ) R70.1 R71.2
N$65: Q5.3(D) R71.1 R72.2
N$66: IC9.7(B:+IN) R73.1
N$67: IC9.6(B:-IN) R74.1
N$68: D16.1(A) Q7.3(D)
N$69: D17.1(A) R76.1
N$70: Q7.1(G) Q8.3(D) R77.1
N$71: IC9.9(C:+IN) R79.1
N$72: IC9.8(C:-IN) R80.2 R81.1
N$73: D18.3(C) R83.2
N$74: R84.1 T11.1(B)
PWM/!VPW: Q5.1(G) ; also sheet 7
PWM_RX: IC9.1(B:OUT) R75.2 ; also sheet 7
V_J1850: IC10.4(OUT) Q7.2(S) R70.2 R77.2

### Notes on the sheet
- SAE J1850 VPW / PWM

## Sheet 12 of 12: holes
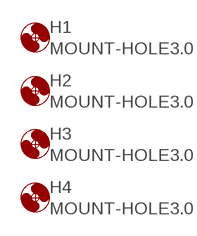
[diagram p11: schematic, sheet 12]

### Parts
H1  MOUNT-HOLE3.0  [3,0]
H2  MOUNT-HOLE3.0  [3,0]
H3  MOUNT-HOLE3.0  [3,0]
H4  MOUNT-HOLE3.0  [3,0]

## Power pins joined to a net without a drawn wire
GND: IC3.7(P:GND)
VCC: IC3.14(P:VCC)

## Library data of the parts
C1-C8 C11 C12 C16-C19 C24-C27 = rcl:C-EU: CAPACITOR, European symbol; SPICEPREFIX: C
C9 C10 C13-C15 = rcl:CPOL-EU: POLARIZED CAPACITOR, European symbol; SPICEPREFIX: C
CON1 CON2 = con-ria:RIA-AKL-230-04
CON3 = con-ria:RIA-AKL-230-03
D1 D6 = diode:SCHOTTKY-DIODE: Schottky Diode
D2 D8 D9 = diode:ZENER-DIODE: Z-Diode
D7 = diode:DIODE-: DIODE
D13 = diode:PESD1CAN: CAN bus ESD protection diode Source: http://www.nxp.com/documents/data_sheet/PESD1CAN.pdf
D14 D15 = diode:BAS40-06: Silicon Schottky Diodes General-purpose diode for high-speed switching
D16-D18 = diode:BAT54: Schottky Diodes Source: Fairchild .. BAT54.pdf
H1-H4 = holes:MOUNT-HOLE: MOUNTING HOLE with drill center marker
IC1 = atmel:MEGA8-P: MICROCONTROLLER 8 Kbytes FLASH, 1 kbytes SRAM, 512 bytes EEPROM, USART, 4-channel 10 bit ADC, 2-channel 8 bit ADC Pin compatible with Atmega48, ATMega88, ATMega168 Source: avr.lbr; OC_FARNELL: unknown; OC_NEWARK: unknown
IC2 = infineon:BTS555: PROFET® Data Sheet BTS555 Source: http://www.infineon.com/upload/Document/cmc_upload/documents/011/8726/Datasheet_BTS555.pdf; OC_FARNELL: unknown; OC_NEWARK: unknown
IC3 = 74xx-eu:74*08: Quad 2-input AND gate
IC4 IC5 = v-reg-3:LM2576: National Semiconductor <http://www.national.com> 3.0A "Simple Switcher"(c) 52kHz, Vout 1.23-37V (HV: 57V), Vin 40V (HV: 60V), 50µA standby current
IC9 = linear3:LM339: Low Power Low Offset Voltage Quad Comparators with open collector; LM139/LM239/LM339/LM2901/LM3302
IC10 = v-reg:LM317?*: 500 mA Adjustable Output Positive Voltage Regulator Source: http://www.onsemi.co.jp .. LM317M-D.PDF
JP1 = pinhead:PINHD-1X3: PIN HEADER
JP2-JP5 = pinhead:PINHD-1X1: PIN HEADER
L1 L2 = own_parts:L-LEU-09HCP
LED1-LED8 LED13-LED17 = led:LED: LED OSRAM: - CHIPLED LG R971, LG N971, LY N971, LG Q971, LY Q971, LO R971, LY R971 LH N974, LH R974 LS Q976, LO Q976, LY Q976 LO Q996 - Hyper CHIPLED LW Q18S LB Q993, LB Q99A, LB R99A - SideLED LS A670, LO A670, LY A670, LG A670, LP A670 LB A673, LV A673, LT A673, LW A673 LH A674 LY A675 LS A676, LA A676, LO A676, LY A676, LW A676 LS A679, LY A679, LG A679 - Hyper Micro SIDELED® LS Y876, LA Y876, LO Y876, LY Y876 LT Y87S - SmartLED LW L88C, LW L88S LB L89C, LB L89S, LG L890 LS L89K, LO L89K, LY L89K LS L896, LA L896, LO L896, LY L896 - TOPLED LS T670, LO T670, LY T670, LG T670, LP T670 LSG T670, LSP T670, LSY T670, LOP T670, LYG T670 LG T671, LOG T671, LSG T671 LB T673, LV T673, LT T673, LW T673 LH T674 LS T676, LA T676, LO T676, LY T676, LB T676, LH T676, LSB T676, LW T676 LB T67C, LV T67C, LT T67C, LS T67K, LO T67K, LY T67K, LW E67C LS E67B, LA E67B, LO E67B, LY E67B, LB E67C, LV E67C, LT E67C LW T67C LS T679, LY T679, LG T679 LS T770, LO T770, LY T770, LG T770, LP T770 LB T773, LV T773, LT T773, LW T773 LH T774 LS E675, LA E675, LY E675, LS T675 LS T776, LA T776, LO T776, LY T776, LB T776 LHGB T686 LT T68C, LB T68C - Hyper Mini TOPLED® LB M676 - Mini TOPLED Santana® LG M470 LS M47K, LO M47K, LY M47K Source: http://www.osram.convergy.de LUXEON: - LUMILED® LXK2-PW12-R00, LXK2-PW12-S00, LXK2-PW14-U00, LXK2-PW14-V00 LXK2-PM12-R00, LXK2-PM12-S00, LXK2-PM14-U00 LXK2-PE12-Q00, LXK2-PE12-R00, LXK2-PE12-S00, LXK2-PE14-T00, LXK2-PE14-U00 LXK2-PB12-K00, LXK2-PB12-L00, LXK2-PB12-M00, LXK2-PB14-N00, LXK2-PB14-P00, LXK2-PB14-Q00 LXK2-PR12-L00, LXK2-PR12-M00, LXK2-PR14-Q00, LXK2-PR14-R00 LXK2-PD12-Q00, LXK2-PD12-R00, LXK2-PD12-S00 LXK2-PH12-R00, LXK2-PH12-S00 LXK2-PL12-P00, LXK2-PL12-Q00, LXK2-PL12-R00 Source: www.luxeon.com KINGBRIGHT: KA-3528ASYC Source: www.kingbright.com
Q1 Q3 = crystal:CRYSTAL: CRYSTAL; OC_FARNELL: 1666969; OC_NEWARK: unknown
Q2 = transistor-power:IRLZ44Z: N-Channel HEXFET® Power MOSFET Logic Level AUTOMOTIVE MOSFET Source: http://www.irf.com/product-info/datasheets/data/irlz44zpbf.pdf
Q4 = transistor-fet:BSO201SP: OptiMOS(R)-P Small-Signal-Transistor P-Channel, Enhancement mode, Super Logic Level (2.5 V rated) RDS(on) 8mOhm, ID -14.9 a Source: http://www.infineon.com/upload/Document/cmc_upload/documents/011/3655/BSO201SP_211201.pdf
Q5 Q8 = transistor-small-signal:BSS123: N-CHANNEL MOS FET
Q7 = transistor-small-signal:BSS84: P-CHANNEL MOS FET
R1-R20 R25-R28 R55-R84 = rcl:R-EU_: RESISTOR, European symbol; SPICEPREFIX: R
S1 S2 = switch-omron:10-XX: OMRON SWITCH; MPN: B3F-1000; OC_FARNELL: 176432; OC_NEWARK: 36M3542
SV1 = con-harting-ml:ML6: HARTING; OC_FARNELL: unknown; OC_NEWARK: unknown
T1 = digital-transistors-2:BCR141: NPN Silicon Digital Transistor 50V 0,1A 0,2W
T2 = transistor:*-PNP-: PNP Transistror
T3 = digital-transistors-2:BCR141S: Dual NPN Silicon Digital Transistor 50V 0,1A 0,25W
T8 T9 = transistor:*-NPN-: NPN Transistror BF959 corrected 2008.03.06
T11 = transistor:BC847: NPN TRANSISTOR
U1 = Bluetooth HC-05:HC_05: HC-05 Bluetooth Module
U3 = MCP2562-E_SN:MCP2562-E/SN: MCP2562 Series 5 V Surface Mount High-Speed CAN Transceiver - SOIC-8; AVAILABILITY: Unavailable; DESCRIPTION: Microchip MCP2562-E/SN, CAN Transceiver 1MBps 1-channel IEC 61000-4-2, 8-Pin SOIC; MF: Microchip; MP: MCP2562-E/SN; PACKAGE: SO-8 Microchip; PRICE: None
U$1 = 1zac:STN1110-SOIC28: OBD Interpreter by STN
X2 = con-subd:M09: SUB-D; OC_FARNELL: unknown; OC_NEWARK: unknown